# Altium project MU_MP_39_V1.PrjPcb (part 2 of 5)

## Sheet 05 CPU_PWR.SchDoc
size 420 x 297 mm; Address1: Address1; Address2: Address2; Address3: Address3; Address4: Address4; DocumentNumber: АБВГ.123456.001 Э3; SheetNumber: 5; SheetTotal: 23; Scale: 1:1; DocumentType: Схема электрическая принципиальная; FirstReferrence: АБВГ.123456.001
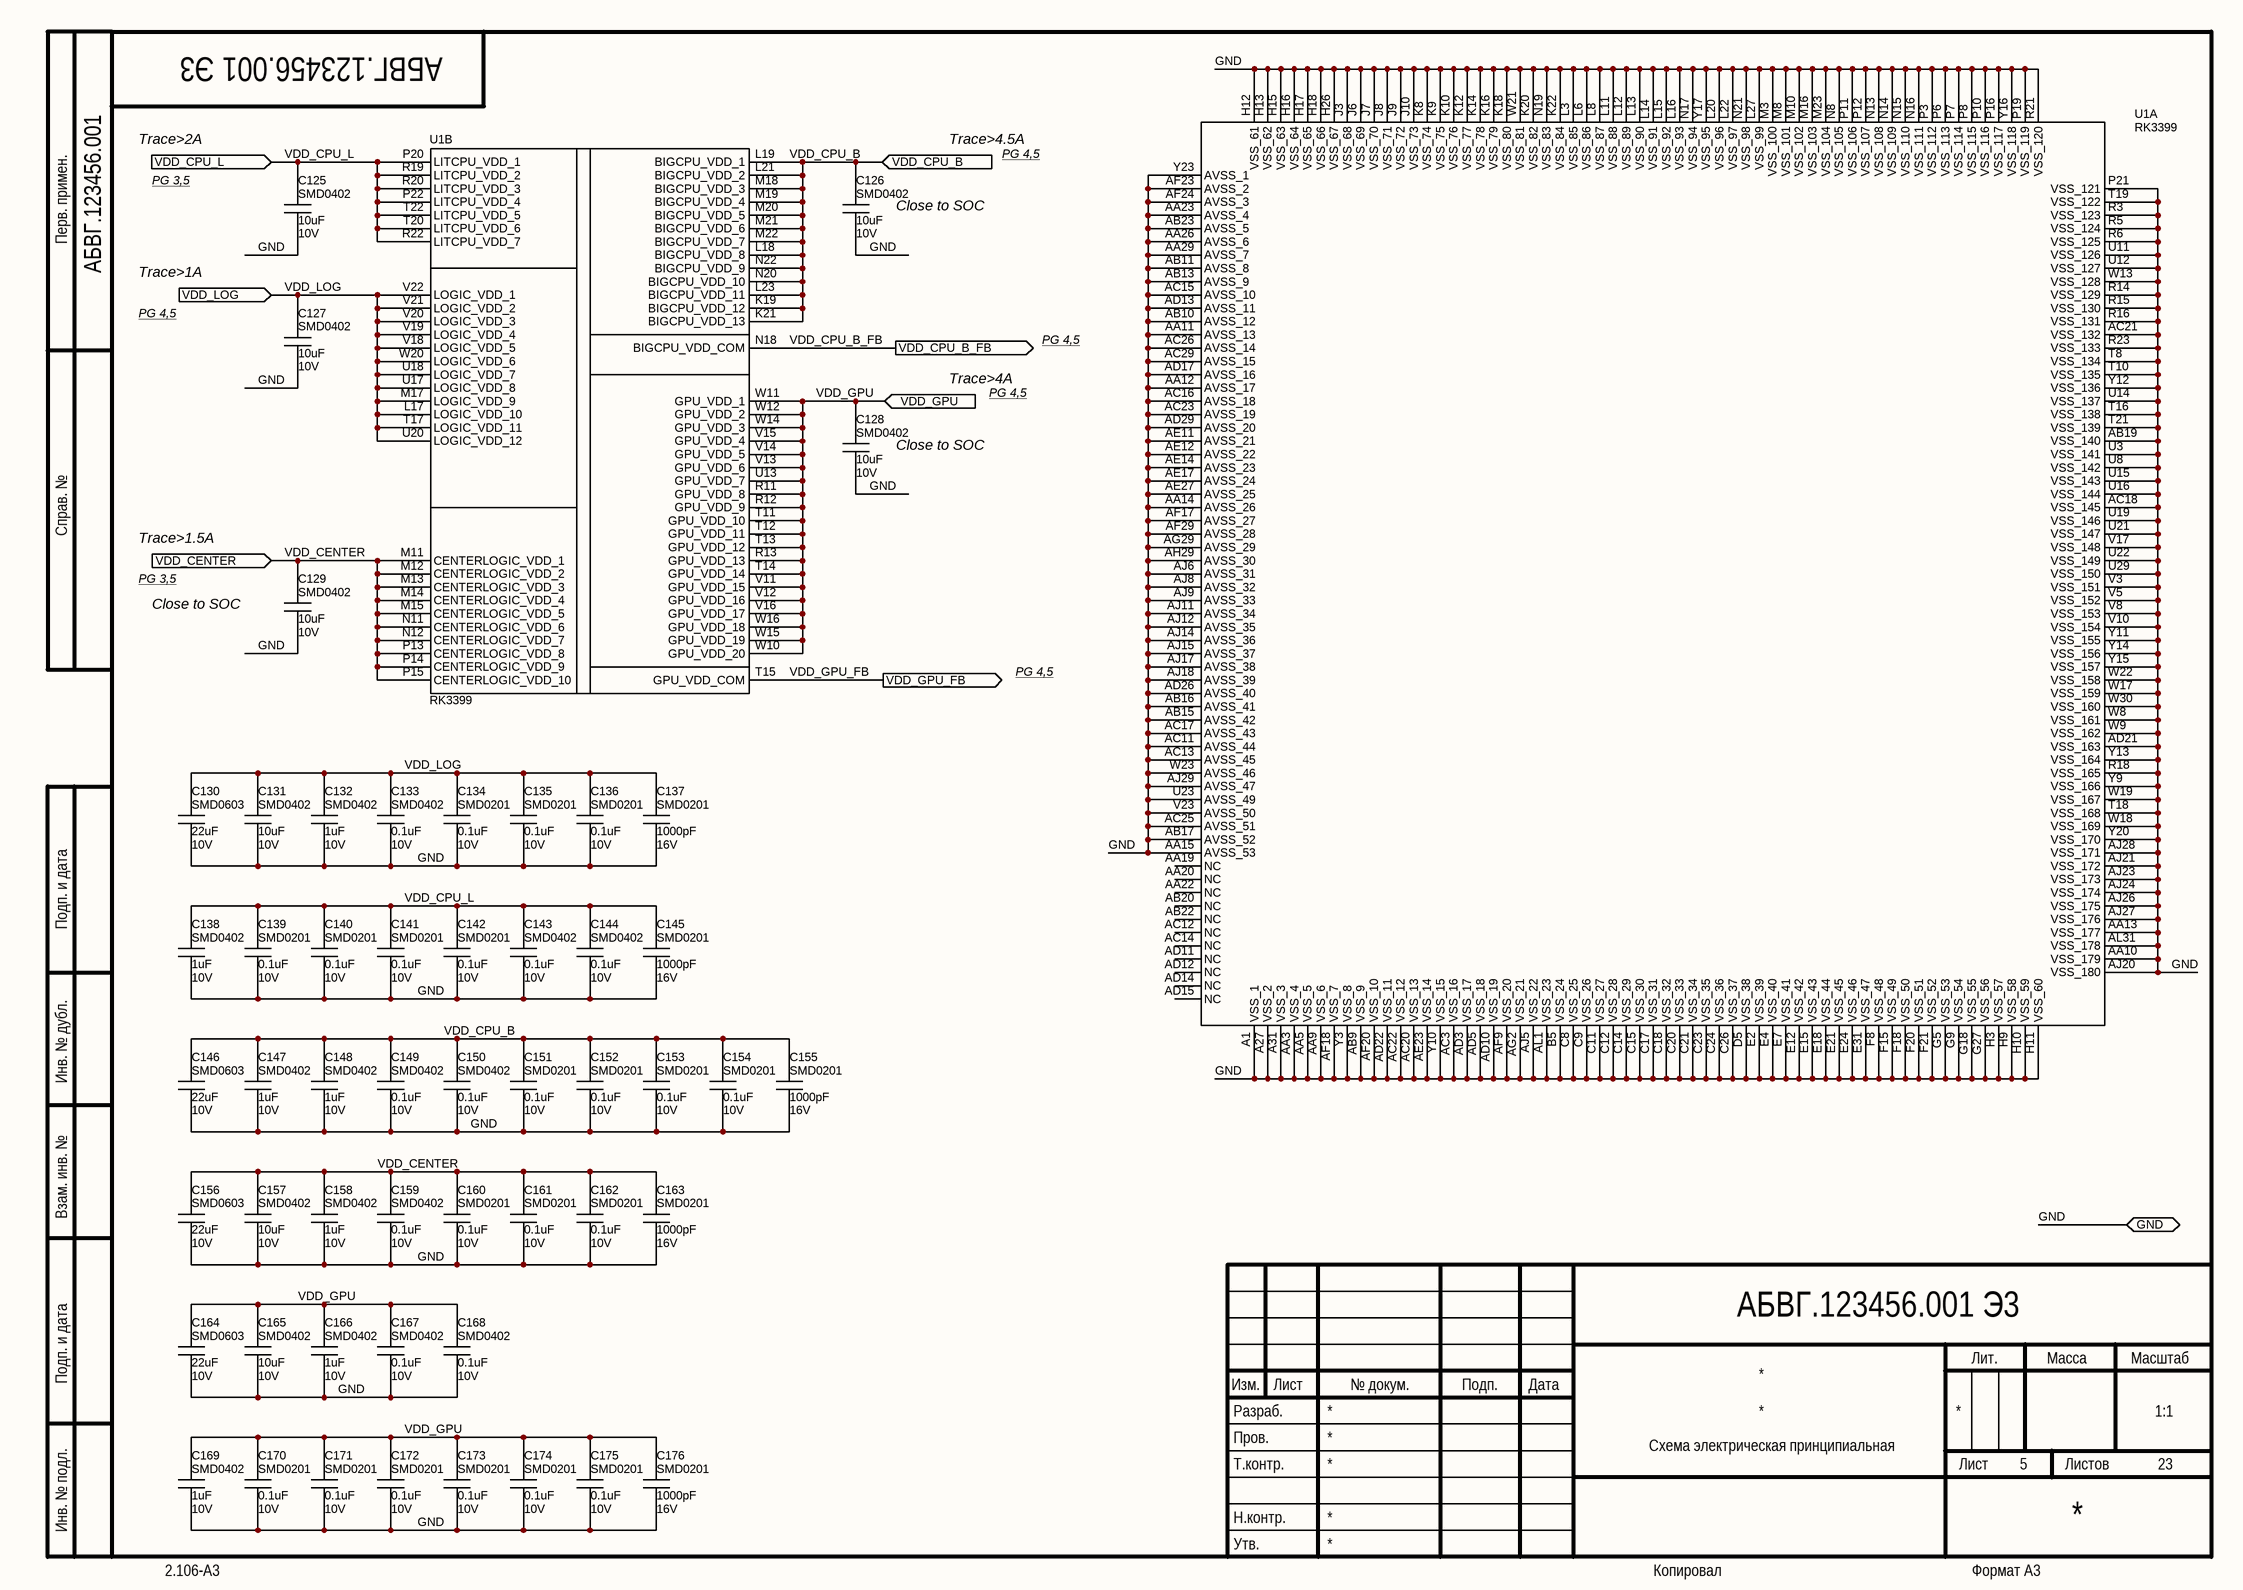
[diagram p4: 05 CPU_PWR.SchDoc]

### Parts
C125  Package: SMD0402  Voltage: 10V  [CAP_SMD_0402_small]  (hidden comment: 10uF)
C126  Package: SMD0402  Voltage: 10V  [CAP_SMD_0402]  (hidden comment: 10uF)
C127  Package: SMD0402  Voltage: 10V  [CAP_SMD_0402_small]  (hidden comment: 10uF)
C128  Package: SMD0402  Voltage: 10V  [CAP_SMD_0402_small]  (hidden comment: 10uF)
C129  Package: SMD0402  Voltage: 10V  [CAP_SMD_0402]  (hidden comment: 10uF)
C130  Package: SMD0603  Voltage: 10V  [CAP_SMD_0603]  (hidden comment: 22uF)
C131  Package: SMD0402  Voltage: 10V  [CAP_SMD_0402_small]  (hidden comment: 10uF)
C132  Package: SMD0402  Voltage: 10V  [CAP_SMD_0402]  (hidden comment: 1uF)
C133  Package: SMD0402  Voltage: 10V  [CAP_SMD_0402]  (hidden comment: 0.1uF)
C134  Package: SMD0201  Voltage: 10V  [CAP_SMD_0201]  (hidden comment: 0.1uF)
C135  Package: SMD0201  Voltage: 10V  [CAP_SMD_0201]  (hidden comment: 0.1uF)
C136  Package: SMD0201  Voltage: 10V  [CAP_SMD_0201]  (hidden comment: 0.1uF)
C137  Package: SMD0201  Voltage: 16V  [CAP_SMD_0201]  (hidden comment: 1000pF)
C138  Package: SMD0402  Voltage: 10V  [CAP_SMD_0402]  (hidden comment: 1uF)
C139  Package: SMD0201  Voltage: 10V  [CAP_SMD_0201]  (hidden comment: 0.1uF)
C140  Package: SMD0201  Voltage: 10V  [CAP_SMD_0201]  (hidden comment: 0.1uF)
C141  Package: SMD0201  Voltage: 10V  [CAP_SMD_0201]  (hidden comment: 0.1uF)
C142  Package: SMD0201  Voltage: 10V  [CAP_SMD_0201]  (hidden comment: 0.1uF)
C143  Package: SMD0402  Voltage: 10V  [CAP_SMD_0402]  (hidden comment: 0.1uF)
C144  Package: SMD0402  Voltage: 10V  [CAP_SMD_0402]  (hidden comment: 0.1uF)
C145  Package: SMD0201  Voltage: 16V  [CAP_SMD_0201]  (hidden comment: 1000pF)
C146  Package: SMD0603  Voltage: 10V  [CAP_SMD_0603]  (hidden comment: 22uF)
C147  Package: SMD0402  Voltage: 10V  [CAP_SMD_0402]  (hidden comment: 1uF)
C148  Package: SMD0402  Voltage: 10V  [CAP_SMD_0402_small]  (hidden comment: 1uF)
C149  Package: SMD0402  Voltage: 10V  [CAP_SMD_0402]  (hidden comment: 0.1uF)
C150  Package: SMD0402  Voltage: 10V  [CAP_SMD_0402]  (hidden comment: 0.1uF)
C151  Package: SMD0201  Voltage: 10V  [CAP_SMD_0201]  (hidden comment: 0.1uF)
C152  Package: SMD0201  Voltage: 10V  [CAP_SMD_0201]  (hidden comment: 0.1uF)
C153  Package: SMD0201  Voltage: 10V  [CAP_SMD_0201]  (hidden comment: 0.1uF)
C154  Package: SMD0201  Voltage: 10V  [CAP_SMD_0201]  (hidden comment: 0.1uF)
C155  Package: SMD0201  Voltage: 16V  [CAP_SMD_0201]  (hidden comment: 1000pF)
C156  Package: SMD0603  Voltage: 10V  [CAP_SMD_0603]  (hidden comment: 22uF)
C157  Package: SMD0402  Voltage: 10V  [CAP_SMD_0402_small]  (hidden comment: 10uF)
C158  Package: SMD0402  Voltage: 10V  [CAP_SMD_0402_small]  (hidden comment: 1uF)
C159  Package: SMD0402  Voltage: 10V  [CAP_SMD_0402]  (hidden comment: 0.1uF)
C160  Package: SMD0201  Voltage: 10V  [CAP_SMD_0201]  (hidden comment: 0.1uF)
C161  Package: SMD0201  Voltage: 10V  [CAP_SMD_0201]  (hidden comment: 0.1uF)
C162  Package: SMD0201  Voltage: 10V  [CAP_SMD_0201]  (hidden comment: 0.1uF)
C163  Package: SMD0201  Voltage: 16V  [CAP_SMD_0201]  (hidden comment: 1000pF)
C164  Package: SMD0603  Voltage: 10V  [CAP_SMD_0603]  (hidden comment: 22uF)
C165  Package: SMD0402  Voltage: 10V  [CAP_SMD_0402]  (hidden comment: 10uF)
C166  Package: SMD0402  Voltage: 10V  [CAP_SMD_0402]  (hidden comment: 1uF)
C167  Package: SMD0402  Voltage: 10V  [CAP_SMD_0402]  (hidden comment: 0.1uF)
C168  Package: SMD0402  Voltage: 10V  [CAP_SMD_0402]  (hidden comment: 0.1uF)
C169  Package: SMD0402  Voltage: 10V  [CAP_SMD_0402_small]  (hidden comment: 1uF)
C170  Package: SMD0201  Voltage: 10V  [CAP_SMD_0201]  (hidden comment: 0.1uF)
C171  Package: SMD0201  Voltage: 10V  [CAP_SMD_0201]  (hidden comment: 0.1uF)
C172  Package: SMD0201  Voltage: 10V  [CAP_SMD_0201]  (hidden comment: 0.1uF)
C173  Package: SMD0201  Voltage: 10V  [CAP_SMD_0201]  (hidden comment: 0.1uF)
C174  Package: SMD0201  Voltage: 10V  [CAP_SMD_0201]  (hidden comment: 0.1uF)
C175  Package: SMD0201  Voltage: 10V  [CAP_SMD_0201]  (hidden comment: 0.1uF)
C176  Package: SMD0201  Voltage: 16V  [CAP_SMD_0201]  (hidden comment: 1000pF)
U1  value RK3399  [BGA828C65P31X31_2100X2100X161N]  (hidden comment: RK3399_FF)  (parts A,B of 23)

### Ports
GND (bidir), VDD_CENTER (in), VDD_CPU_B (in), VDD_CPU_B_FB (out), VDD_CPU_L (in), VDD_GPU (in), VDD_GPU_FB (out), VDD_LOG (in)

### Nets
GND: C125.2 C126.2 C127.2 C128.2 C129.2 C130.1 C131.2 C132.2 C133.2 C134.2 C135.2 C136.2 C137.2 C138.2 C139.2 C140.2 C141.2 C142.2 C143.2 C144.2 C145.2 C146.1 C147.2 C148.2 C149.2 C150.2 C151.2 C152.2 C153.2 C154.2 C155.2 C156.1 C157.2 C158.2 C159.2 C160.2 C161.2 C162.2 C163.2 C164.1 C165.2 C166.2 C167.2 C168.2 C169.2 C170.2 C171.2 C172.2 C173.2 C174.2 C175.2 C176.2 U1.A1(VSS_1) U1.A27(VSS_2) U1.A31(VSS_3) U1.AA3(VSS_4) U1.AA5(VSS_5) U1.AA9(VSS_6) U1.AA10(VSS_179) U1.AA11(AVSS_13) U1.AA12(AVSS_17) U1.AA13(VSS_177) U1.AA14(AVSS_26) U1.AA15(AVSS_53) U1.AA23(AVSS_4) U1.AA26(AVSS_6) U1.AA29(AVSS_7) U1.AB9(VSS_9) U1.AB10(AVSS_12) U1.AB11(AVSS_8) U1.AB13(AVSS_9) U1.AB15(AVSS_42) U1.AB16(AVSS_41) U1.AB17(AVSS_52) U1.AB19(VSS_140) U1.AB23(AVSS_5) U1.AC3(VSS_16) U1.AC11(AVSS_44) U1.AC13(AVSS_45) U1.AC15(AVSS_10) U1.AC16(AVSS_18) U1.AC17(AVSS_43) U1.AC18(VSS_145) U1.AC20(VSS_13) U1.AC21(VSS_132) U1.AC22(VSS_12) U1.AC23(AVSS_19) U1.AC25(AVSS_51) U1.AC26(AVSS_14) U1.AC29(AVSS_15) U1.AD3(VSS_17) U1.AD5(VSS_18) U1.AD10(VSS_19) U1.AD13(AVSS_11) U1.AD17(AVSS_16) U1.AD21(VSS_163) U1.AD22(VSS_11) U1.AD26(AVSS_40) U1.AD29(AVSS_20) U1.AE11(AVSS_21) U1.AE12(AVSS_22) U1.AE14(AVSS_23) U1.AE17(AVSS_24) U1.AE23(VSS_14) U1.AE27(AVSS_25) U1.AF9(VSS_20) U1.AF17(AVSS_27) U1.AF18(VSS_7) U1.AF20(VSS_10) U1.AF23(AVSS_2) U1.AF24(AVSS_3) U1.AF29(AVSS_28) U1.AG2(VSS_21) U1.AG29(AVSS_29) U1.AH29(AVSS_30) U1.AJ5(VSS_22) U1.AJ6(AVSS_31) U1.AJ8(AVSS_32) U1.AJ9(AVSS_33) U1.AJ11(AVSS_34) U1.AJ12(AVSS_35) U1.AJ14(AVSS_36) U1.AJ15(AVSS_37) U1.AJ17(AVSS_38) U1.AJ18(AVSS_39) U1.AJ20(VSS_180) U1.AJ21(VSS_172) U1.AJ23(VSS_173) U1.AJ24(VSS_174) U1.AJ26(VSS_175) U1.AJ27(VSS_176) U1.AJ28(VSS_171) U1.AJ29(AVSS_47) U1.AL1(VSS_23) U1.AL31(VSS_178) U1.B5(VSS_24) U1.C8(VSS_25) U1.C9(VSS_26) U1.C11(VSS_27) U1.C12(VSS_28) U1.C14(VSS_29) U1.C15(VSS_30) U1.C17(VSS_31) U1.C18(VSS_32) U1.C20(VSS_33) U1.C21(VSS_34) U1.C23(VSS_35) U1.C24(VSS_36) U1.C26(VSS_37) U1.D5(VSS_38) U1.E2(VSS_39) U1.E4(VSS_40) U1.E7(VSS_41) U1.E12(VSS_42) U1.E15(VSS_43) U1.E18(VSS_44) U1.E21(VSS_45) U1.E24(VSS_46) U1.E31(VSS_47) U1.F8(VSS_48) U1.F15(VSS_49) U1.F18(VSS_50) U1.F20(VSS_51) U1.F21(VSS_52) U1.G5(VSS_53) U1.G9(VSS_54) U1.G18(VSS_55) U1.G27(VSS_56) U1.H3(VSS_57) U1.H9(VSS_58) U1.H10(VSS_59) U1.H11(VSS_60) U1.H12(VSS_61) U1.H13(VSS_62) U1.H15(VSS_63) U1.H16(VSS_64) U1.H17(VSS_65) U1.H18(VSS_66) U1.H26(VSS_67) U1.J3(VSS_68) U1.J6(VSS_69) U1.J7(VSS_70) U1.J8(VSS_71) U1.J9(VSS_72) U1.J10(VSS_73) U1.K8(VSS_74) U1.K9(VSS_75) U1.K10(VSS_76) U1.K12(VSS_77) U1.K14(VSS_78) U1.K16(VSS_79) U1.K18(VSS_80) U1.K20(VSS_82) U1.K22(VSS_84) U1.L3(VSS_85) U1.L6(VSS_86) U1.L8(VSS_87) U1.L11(VSS_88) U1.L12(VSS_89) U1.L13(VSS_90) U1.L14(VSS_91) U1.L15(VSS_92) U1.L16(VSS_93) U1.L20(VSS_96) U1.L22(VSS_97) U1.L27(VSS_99) U1.M3(VSS_100) U1.M8(VSS_101) U1.M10(VSS_102) U1.M16(VSS_103) U1.M23(VSS_104) U1.N8(VSS_105) U1.N13(VSS_108) U1.N14(VSS_109) U1.N15(VSS_110) U1.N16(VSS_111) U1.N17(VSS_94) U1.N19(VSS_83) U1.N21(VSS_98) U1.P3(VSS_112) U1.P6(VSS_113) U1.P7(VSS_114) U1.P8(VSS_115) U1.P10(VSS_116) U1.P11(VSS_106) U1.P12(VSS_107) U1.P16(VSS_117) U1.P19(VSS_119) U1.P21(VSS_121) U1.R3(VSS_123) U1.R5(VSS_124) U1.R6(VSS_125) U1.R14(VSS_129) U1.R15(VSS_130) U1.R16(VSS_131) U1.R18(VSS_165) U1.R21(VSS_120) U1.R23(VSS_133) U1.T8(VSS_134) U1.T10(VSS_135) U1.T16(VSS_138) U1.T18(VSS_168) U1.T19(VSS_122) U1.T21(VSS_139) U1.U3(VSS_141) U1.U8(VSS_142) U1.U11(VSS_126) U1.U12(VSS_127) U1.U14(VSS_137) U1.U15(VSS_143) U1.U16(VSS_144) U1.U19(VSS_146) U1.U21(VSS_147) U1.U22(VSS_149) U1.U23(AVSS_49) U1.U29(VSS_150) U1.V3(VSS_151) U1.V5(VSS_152) U1.V8(VSS_153) U1.V10(VSS_154) U1.V17(VSS_148) U1.V23(AVSS_50) U1.W8(VSS_161) U1.W9(VSS_162) U1.W13(VSS_128) U1.W17(VSS_159) U1.W18(VSS_169) U1.W19(VSS_167) U1.W21(VSS_81) U1.W22(VSS_158) U1.W23(AVSS_46) U1.W30(VSS_160) U1.Y3(VSS_8) U1.Y9(VSS_166) U1.Y10(VSS_15) U1.Y11(VSS_155) U1.Y12(VSS_136) U1.Y13(VSS_164) U1.Y14(VSS_156) U1.Y15(VSS_157) U1.Y16(VSS_118) U1.Y17(VSS_95) U1.Y20(VSS_170) U1.Y23(AVSS_1) ; port GND
VDD_CENTER: C129.1 C156.2 C157.1 C158.1 C159.1 C160.1 C161.1 C162.1 C163.1 U1.M11(CENTERLOGIC_VDD_1) U1.M12(CENTERLOGIC_VDD_2) U1.M13(CENTERLOGIC_VDD_3) U1.M14(CENTERLOGIC_VDD_4) U1.M15(CENTERLOGIC_VDD_5) U1.N11(CENTERLOGIC_VDD_6) U1.N12(CENTERLOGIC_VDD_7) U1.P13(CENTERLOGIC_VDD_8) U1.P14(CENTERLOGIC_VDD_9) U1.P15(CENTERLOGIC_VDD_10) ; port VDD_CENTER
VDD_CPU_B: C126.1 C146.2 C147.1 C148.1 C149.1 C150.1 C151.1 C152.1 C153.1 C154.1 C155.1 U1.K19(BIGCPU_VDD_12) U1.K21(BIGCPU_VDD_13) U1.L18(BIGCPU_VDD_8) U1.L19(BIGCPU_VDD_1) U1.L21(BIGCPU_VDD_2) U1.L23(BIGCPU_VDD_11) U1.M18(BIGCPU_VDD_3) U1.M19(BIGCPU_VDD_4) U1.M20(BIGCPU_VDD_5) U1.M21(BIGCPU_VDD_6) U1.M22(BIGCPU_VDD_7) U1.N20(BIGCPU_VDD_10) U1.N22(BIGCPU_VDD_9) ; port VDD_CPU_B
VDD_CPU_B_FB: U1.N18(BIGCPU_VDD_COM) ; port VDD_CPU_B_FB
VDD_CPU_L: C125.1 C138.1 C139.1 C140.1 C141.1 C142.1 C143.1 C144.1 C145.1 U1.P20(LITCPU_VDD_1) U1.P22(LITCPU_VDD_4) U1.R19(LITCPU_VDD_2) U1.R20(LITCPU_VDD_3) U1.R22(LITCPU_VDD_7) U1.T20(LITCPU_VDD_6) U1.T22(LITCPU_VDD_5) ; port VDD_CPU_L
VDD_GPU: C128.1 C164.2 C165.1 C166.1 C167.1 C168.1 C169.1 C170.1 C171.1 C172.1 C173.1 C174.1 C175.1 C176.1 U1.R11(GPU_VDD_8) U1.R12(GPU_VDD_9) U1.R13(GPU_VDD_13) U1.T11(GPU_VDD_10) U1.T12(GPU_VDD_11) U1.T13(GPU_VDD_12) U1.T14(GPU_VDD_14) U1.U13(GPU_VDD_7) U1.V11(GPU_VDD_15) U1.V12(GPU_VDD_16) U1.V13(GPU_VDD_6) U1.V14(GPU_VDD_5) U1.V15(GPU_VDD_4) U1.V16(GPU_VDD_17) U1.W10(GPU_VDD_20) U1.W11(GPU_VDD_1) U1.W12(GPU_VDD_2) U1.W14(GPU_VDD_3) U1.W15(GPU_VDD_19) U1.W16(GPU_VDD_18) ; port VDD_GPU
VDD_GPU_FB: U1.T15(GPU_VDD_COM) ; port VDD_GPU_FB
VDD_LOG: C127.1 C130.2 C131.1 C132.1 C133.1 C134.1 C135.1 C136.1 C137.1 U1.L17(LOGIC_VDD_10) U1.M17(LOGIC_VDD_9) U1.T17(LOGIC_VDD_11) U1.U17(LOGIC_VDD_8) U1.U18(LOGIC_VDD_7) U1.U20(LOGIC_VDD_12) U1.V18(LOGIC_VDD_5) U1.V19(LOGIC_VDD_4) U1.V20(LOGIC_VDD_3) U1.V21(LOGIC_VDD_2) U1.V22(LOGIC_VDD_1) U1.W20(LOGIC_VDD_6) ; port VDD_LOG

Not connected (* = marked no-connect by the designer): U1 AA19(NC) AA20(NC) AA22(NC) AB20(NC) AB22(NC) AC12(NC) AC14(NC) AD11(NC) AD12(NC) AD14(NC) AD15(NC)

### Notes on the sheet
- Trace>2A
- PG 3,5
- Trace>4.5A
- PG 4,5
- Перв. примен.
- (near C126) Close to SOC
- Trace>1A
- Trace>4A
- (near C128) Close to SOC
- Справ. №
- Trace>1.5A
- Close to SOC
- Подп. и дата
- Инв. № дубл.
- Взам. инв. №
- Разраб.
- Изм.
- Лист
- № докум.
- Подп.
- Дата
- Лит.
- Масса
- Масштаб
- Пров.
- Т.контр.
- Листов
- Инв. № подл.
- Утв.
- Н.контр.
- 2.106-A3
- Копировал
- Формат А3

### Library data of the parts
C125-C129 C131 C157 C165 = Ceramic_Cap: PartNumber: CC0402MRX5R6BB106; ComponentType: SMD Ceramic Chip Capacitor; Manufacter: *; Tolerance: *; Value: 10uF
  C125 C127 C128 C131 C157: ClassName: Solder_Clearence
  C126 C129 C165: ClassName: *
C130 C146 C156 C164 = Ceramic_Cap: PartNumber: CL10A226MP8NUNE; ComponentType: SMD Ceramic Chip Capacitor; Manufacter: *; Tolerance: *; ClassName: *; Value: 22uF
C132 C138 C147 C148 C158 C166 C169 = Ceramic_Cap: PartNumber: CC0402KRX5R6BB105; ComponentType: SMD Ceramic Chip Capacitor; Manufacter: *; Tolerance: *; Value: 1uF
  C132 C138 C147 C166: ClassName: *
  C148 C158 C169: ClassName: Solder_Clearence
C133 C143 C144 C149 C150 C159 C167 C168 = Ceramic_Cap: PartNumber: CC0402KRX5R6BB104; ComponentType: SMD Ceramic Chip Capacitor; Manufacter: *; Tolerance: *; ClassName: *; Value: 0.1uF
C134-C136 C139-C142 C151-C154 C160-C162 C170-C175 = Ceramic_Cap: PartNumber: CC0201KRX5R6BB104; ComponentType: SMD Ceramic Chip Capacitor; Manufacter: *; Tolerance: *; ClassName: *; Value: 0.1uF
C137 C145 C155 C163 C176 = Ceramic_Cap: PartNumber: CC0201KRX7R7BB102; ComponentType: SMD Ceramic Chip Capacitor; Manufacter: *; Tolerance: *; ClassName: *; Value: 1000pF
U1 = RK3399_FF: Package: BGA828; ComponentType: *; Manufacter: *; PartNumber: RK3399; ClassName: *

## Sheet 06 CPU_RAM.SchDoc
size 420 x 297 mm; Address1: Address1; Address2: Address2; Address3: Address3; Address4: Address4; DocumentNumber: АБВГ.123456.001 Э3; SheetNumber: 6; SheetTotal: 23; Scale: 1:1; DocumentType: Схема электрическая принципиальная; FirstReferrence: АБВГ.123456.001
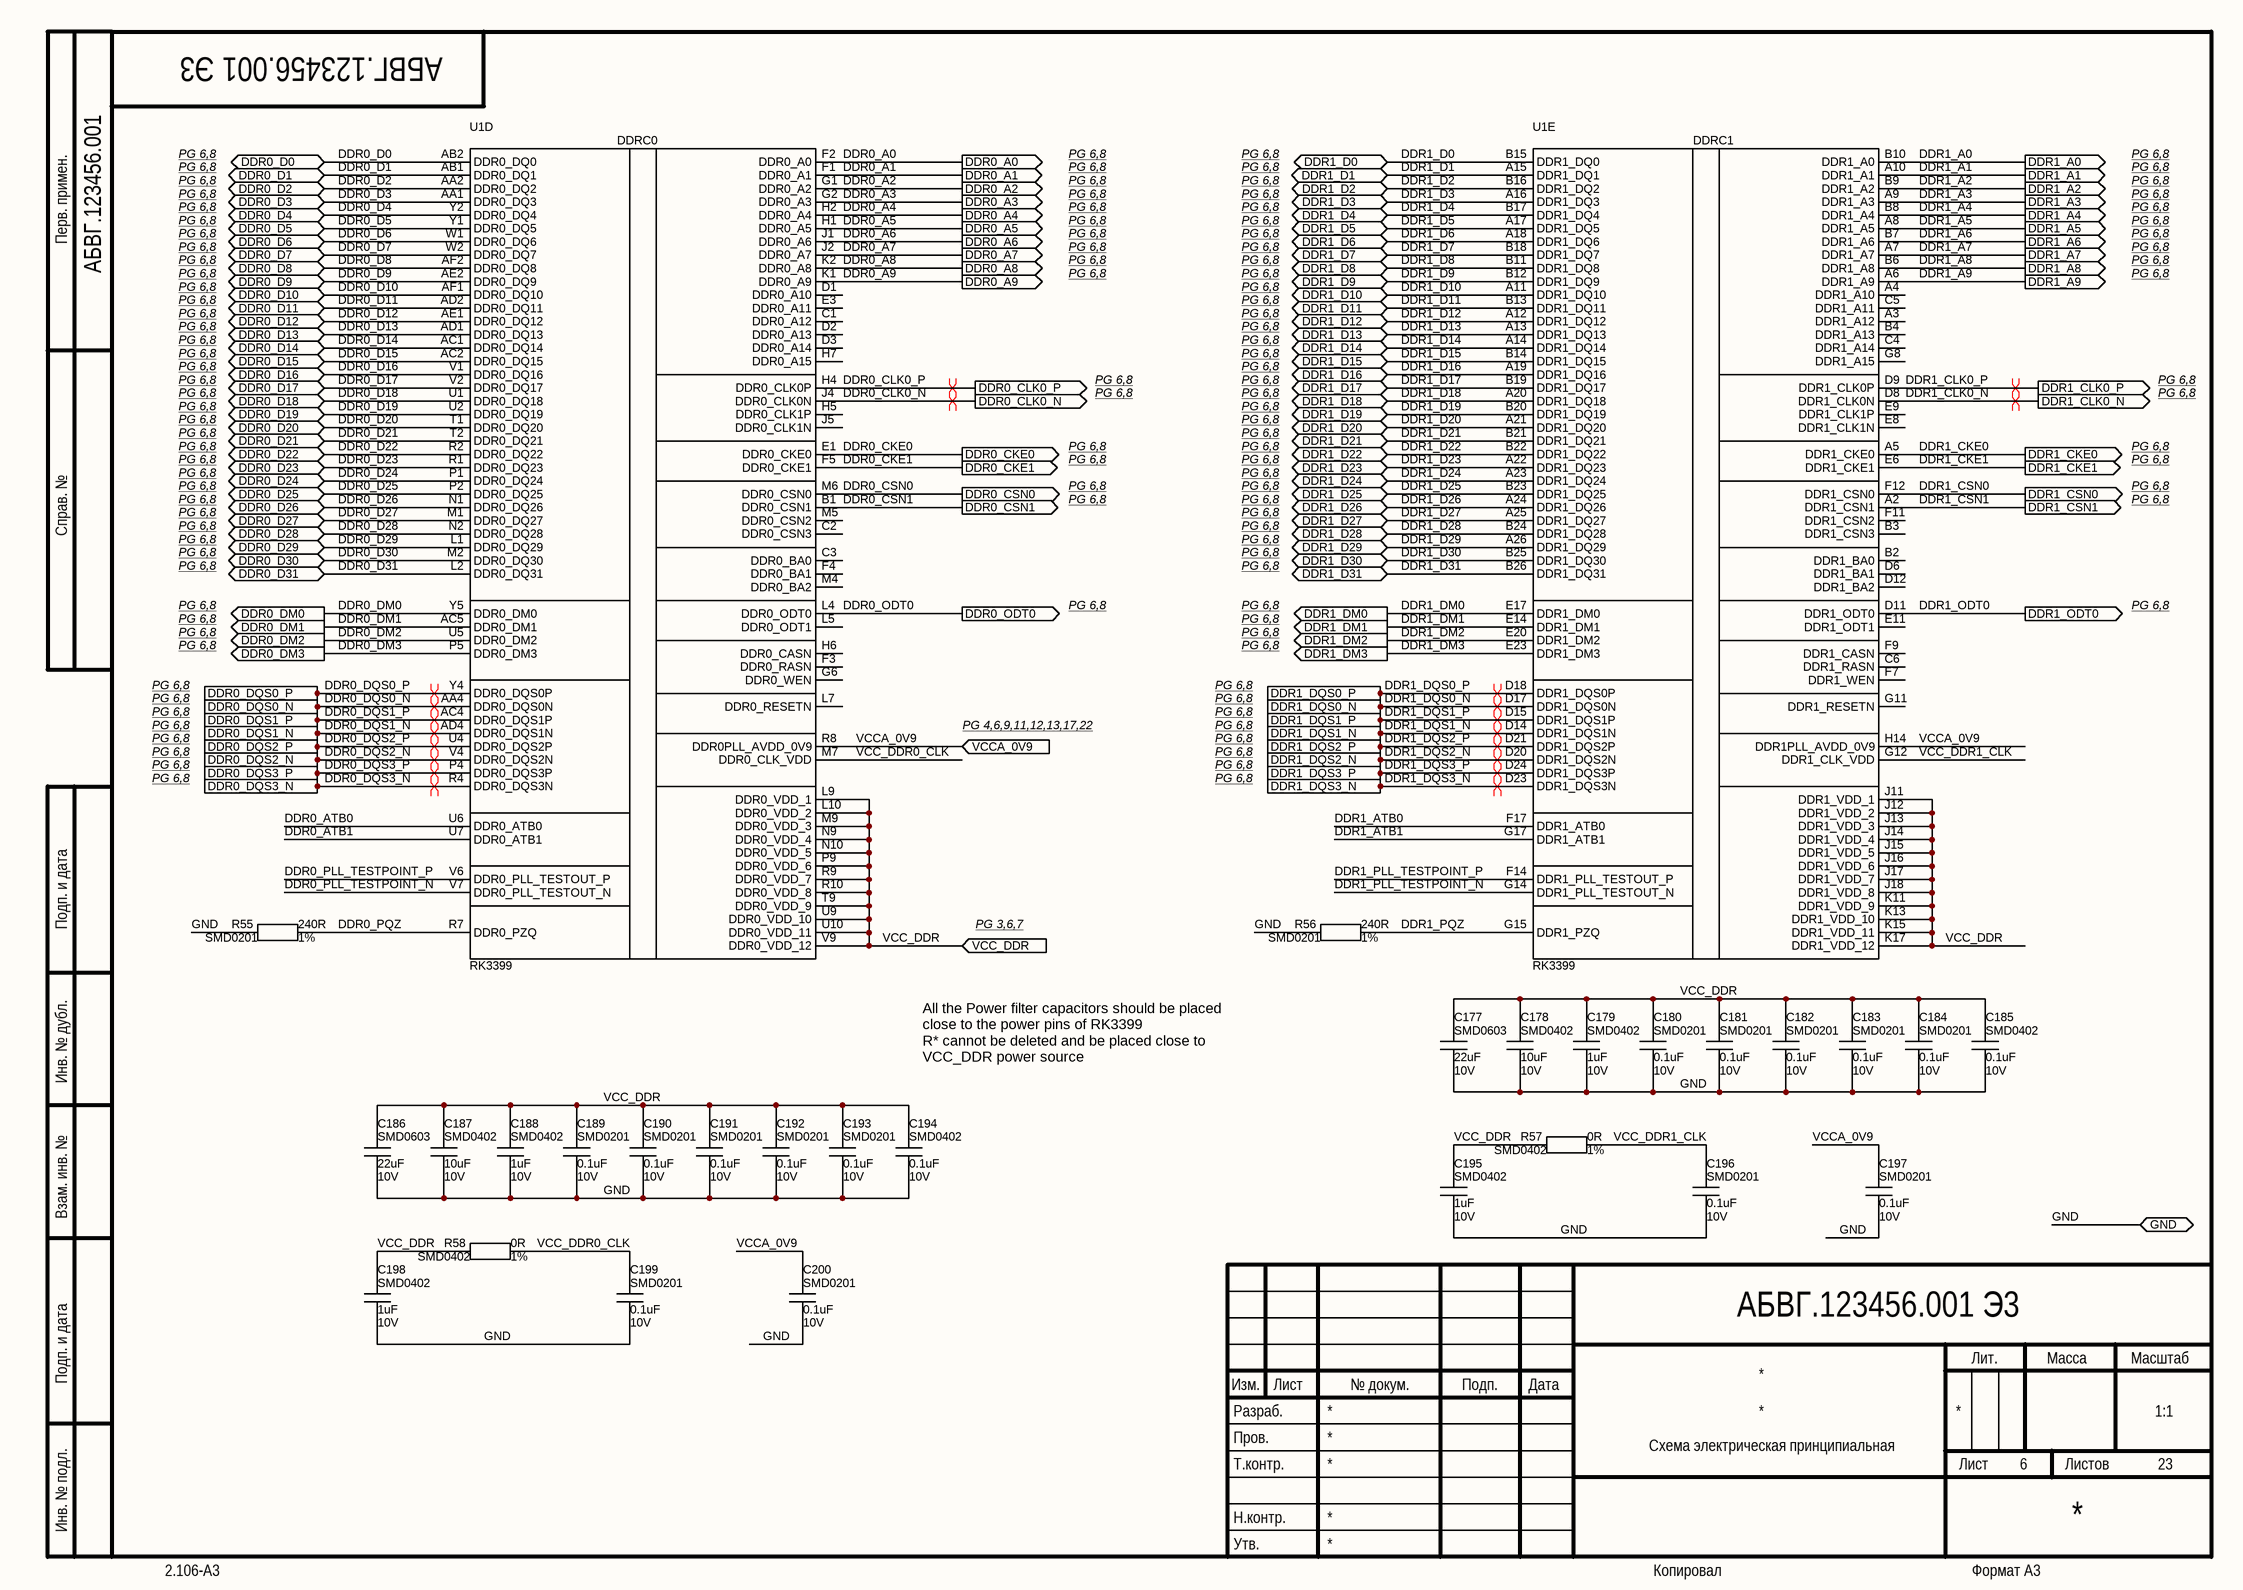
[diagram p5: 06 CPU_RAM.SchDoc]

### Parts
C177  Package: SMD0603  Voltage: 10V  [CAP_SMD_0603]  (hidden comment: 22uF)
C178  Package: SMD0402  Voltage: 10V  [CAP_SMD_0402_small]  (hidden comment: 10uF)
C179  Package: SMD0402  Voltage: 10V  [CAP_SMD_0402_small]  (hidden comment: 1uF)
C180  Package: SMD0201  Voltage: 10V  [CAP_SMD_0201]  (hidden comment: 0.1uF)
C181  Package: SMD0201  Voltage: 10V  [CAP_SMD_0201]  (hidden comment: 0.1uF)
C182  Package: SMD0201  Voltage: 10V  [CAP_SMD_0201]  (hidden comment: 0.1uF)
C183  Package: SMD0201  Voltage: 10V  [CAP_SMD_0201]  (hidden comment: 0.1uF)
C184  Package: SMD0201  Voltage: 10V  [CAP_SMD_0201]  (hidden comment: 0.1uF)
C185  Package: SMD0402  Voltage: 10V  [CAP_SMD_0402]  (hidden comment: 0.1uF)
C186  Package: SMD0603  Voltage: 10V  [CAP_SMD_0603]  (hidden comment: 22uF)
C187  Package: SMD0402  Voltage: 10V  [CAP_SMD_0402_small]  (hidden comment: 10uF)
C188  Package: SMD0402  Voltage: 10V  [CAP_SMD_0402_small]  (hidden comment: 1uF)
C189  Package: SMD0201  Voltage: 10V  [CAP_SMD_0201]  (hidden comment: 0.1uF)
C190  Package: SMD0201  Voltage: 10V  [CAP_SMD_0201]  (hidden comment: 0.1uF)
C191  Package: SMD0201  Voltage: 10V  [CAP_SMD_0201]  (hidden comment: 0.1uF)
C192  Package: SMD0201  Voltage: 10V  [CAP_SMD_0201]  (hidden comment: 0.1uF)
C193  Package: SMD0201  Voltage: 10V  [CAP_SMD_0201]  (hidden comment: 0.1uF)
C194  Package: SMD0402  Voltage: 10V  [CAP_SMD_0402]  (hidden comment: 0.1uF)
C195  Package: SMD0402  Voltage: 10V  [CAP_SMD_0402_small]  (hidden comment: 1uF)
C196  Package: SMD0201  Voltage: 10V  [CAP_SMD_0201]  (hidden comment: 0.1uF)
C197  Package: SMD0201  Voltage: 10V  [CAP_SMD_0201]  (hidden comment: 0.1uF)
C198  Package: SMD0402  Voltage: 10V  [CAP_SMD_0402_small]  (hidden comment: 1uF)
C199  Package: SMD0201  Voltage: 10V  [CAP_SMD_0201]  (hidden comment: 0.1uF)
C200  Package: SMD0201  Voltage: 10V  [CAP_SMD_0201]  (hidden comment: 0.1uF)
R55  Package: SMD0201  Tolerance: 1%  [RES_SMD_0201]  (hidden comment: 240R)
R56  Package: SMD0201  Tolerance: 1%  [RES_SMD_0201]  (hidden comment: 240R)
R57  Package: SMD0402  Tolerance: 1%  [RES_SMD_0402_SMALL]  (hidden comment: 0R)
R58  Package: SMD0402  Tolerance: 1%  [RES_SMD_0402_SMALL]  (hidden comment: 0R)
U1  value RK3399  [BGA828C65P31X31_2100X2100X161N]  (hidden comment: RK3399_FF)  (parts D,E of 23)

### Ports
DDR0_A0 (out), DDR0_A1 (out), DDR0_A2 (out), DDR0_A3 (out), DDR0_A4 (out), DDR0_A5 (out), DDR0_A6 (out), DDR0_A7 (out), DDR0_A8 (out), DDR0_A9 (out), DDR0_CKE0 (out), DDR0_CKE1 (out), DDR0_CLK0_N (out), DDR0_CLK0_P (out), DDR0_CSN0 (out), DDR0_CSN1 (out), DDR0_D0 (bidir), DDR0_D1 (bidir), DDR0_D2 (bidir), DDR0_D3 (bidir), DDR0_D4 (bidir), DDR0_D5 (bidir), DDR0_D6 (bidir), DDR0_D7 (bidir), DDR0_D8 (bidir), DDR0_D9 (bidir), DDR0_D10 (bidir), DDR0_D11 (bidir), DDR0_D12 (bidir), DDR0_D13 (bidir), DDR0_D14 (bidir), DDR0_D15 (bidir), DDR0_D16 (bidir), DDR0_D17 (bidir), DDR0_D18 (bidir), DDR0_D19 (bidir), DDR0_D20 (bidir), DDR0_D21 (bidir), DDR0_D22 (bidir), DDR0_D23 (bidir), DDR0_D24 (bidir), DDR0_D25 (bidir), DDR0_D26 (bidir), DDR0_D27 (bidir), DDR0_D28 (bidir), DDR0_D29 (bidir), DDR0_D30 (bidir), DDR0_D31 (bidir), DDR0_DM0 (out), DDR0_DM1 (out), DDR0_DM2 (out), DDR0_DM3 (out), DDR0_DQS0_N (out), DDR0_DQS0_P (out), DDR0_DQS1_N (out), DDR0_DQS1_P (out), DDR0_DQS2_N (out), DDR0_DQS2_P (out), DDR0_DQS3_N (out), DDR0_DQS3_P (out), DDR0_ODT0 (out), DDR1_A0 (out), DDR1_A1 (out), DDR1_A2 (out), DDR1_A3 (out), DDR1_A4 (out), DDR1_A5 (out), DDR1_A6 (out), DDR1_A7 (out), DDR1_A8 (out), DDR1_A9 (out), DDR1_CKE0 (out), DDR1_CKE1 (out), DDR1_CLK0_N (out), DDR1_CLK0_P (out), DDR1_CSN0 (out), DDR1_CSN1 (out), DDR1_D0 (bidir), DDR1_D1 (bidir), DDR1_D2 (bidir), DDR1_D3 (bidir), DDR1_D4 (bidir), DDR1_D5 (bidir), DDR1_D6 (bidir), DDR1_D7 (bidir), DDR1_D8 (bidir), DDR1_D9 (bidir), DDR1_D10 (bidir), DDR1_D11 (bidir), DDR1_D12 (bidir), DDR1_D13 (bidir), DDR1_D14 (bidir), DDR1_D15 (bidir), DDR1_D16 (bidir), DDR1_D17 (bidir), DDR1_D18 (bidir), DDR1_D19 (bidir), DDR1_D20 (bidir), DDR1_D21 (bidir), DDR1_D22 (bidir), DDR1_D23 (bidir), DDR1_D24 (bidir), DDR1_D25 (bidir), DDR1_D26 (bidir), DDR1_D27 (bidir), DDR1_D28 (bidir), DDR1_D29 (bidir), DDR1_D30 (bidir), DDR1_D31 (bidir), DDR1_DM0 (out), DDR1_DM1 (out), DDR1_DM2 (out), DDR1_DM3 (out), DDR1_DQS0_N (out), DDR1_DQS0_P (out), DDR1_DQS1_N (out), DDR1_DQS1_P (out), DDR1_DQS2_N (out), DDR1_DQS2_P (out), DDR1_DQS3_N (out), DDR1_DQS3_P (out), DDR1_ODT0 (out), GND (bidir), VCC_DDR (in), VCCA_0V9 (in)

### Nets
DDR0_A0: U1.F2(DDR0_A0) ; port DDR0_A0
DDR0_A1: U1.F1(DDR0_A1) ; port DDR0_A1
DDR0_A2: U1.G1(DDR0_A2) ; port DDR0_A2
DDR0_A3: U1.G2(DDR0_A3) ; port DDR0_A3
DDR0_A4: U1.H2(DDR0_A4) ; port DDR0_A4
DDR0_A5: U1.H1(DDR0_A5) ; port DDR0_A5
DDR0_A6: U1.J1(DDR0_A6) ; port DDR0_A6
DDR0_A7: U1.J2(DDR0_A7) ; port DDR0_A7
DDR0_A8: U1.K2(DDR0_A8) ; port DDR0_A8
DDR0_A9: U1.K1(DDR0_A9) ; port DDR0_A9
DDR0_ATB0: U1.U6(DDR0_ATB0)
DDR0_ATB1: U1.U7(DDR0_ATB1)
DDR0_CKE0: U1.E1(DDR0_CKE0) ; port DDR0_CKE0
DDR0_CKE1: U1.F5(DDR0_CKE1) ; port DDR0_CKE1
DDR0_CLK0_N: U1.J4(DDR0_CLK0N) ; port DDR0_CLK0_N
DDR0_CLK0_P: U1.H4(DDR0_CLK0P) ; port DDR0_CLK0_P
DDR0_CSN0: U1.M6(DDR0_CSN0) ; port DDR0_CSN0
DDR0_CSN1: U1.B1(DDR0_CSN1) ; port DDR0_CSN1
DDR0_D0: U1.AB2(DDR0_DQ0) ; port DDR0_D0
DDR0_D1: U1.AB1(DDR0_DQ1) ; port DDR0_D1
DDR0_D2: U1.AA2(DDR0_DQ2) ; port DDR0_D2
DDR0_D3: U1.AA1(DDR0_DQ3) ; port DDR0_D3
DDR0_D4: U1.Y2(DDR0_DQ4) ; port DDR0_D4
DDR0_D5: U1.Y1(DDR0_DQ5) ; port DDR0_D5
DDR0_D6: U1.W1(DDR0_DQ6) ; port DDR0_D6
DDR0_D7: U1.W2(DDR0_DQ7) ; port DDR0_D7
DDR0_D8: U1.AF2(DDR0_DQ8) ; port DDR0_D8
DDR0_D9: U1.AE2(DDR0_DQ9) ; port DDR0_D9
DDR0_D10: U1.AF1(DDR0_DQ10) ; port DDR0_D10
DDR0_D11: U1.AD2(DDR0_DQ11) ; port DDR0_D11
DDR0_D12: U1.AE1(DDR0_DQ12) ; port DDR0_D12
DDR0_D13: U1.AD1(DDR0_DQ13) ; port DDR0_D13
DDR0_D14: U1.AC1(DDR0_DQ14) ; port DDR0_D14
DDR0_D15: U1.AC2(DDR0_DQ15) ; port DDR0_D15
DDR0_D16: U1.V1(DDR0_DQ16) ; port DDR0_D16
DDR0_D17: U1.V2(DDR0_DQ17) ; port DDR0_D17
DDR0_D18: U1.U1(DDR0_DQ18) ; port DDR0_D18
DDR0_D19: U1.U2(DDR0_DQ19) ; port DDR0_D19
DDR0_D20: U1.T1(DDR0_DQ20) ; port DDR0_D20
DDR0_D21: U1.T2(DDR0_DQ21) ; port DDR0_D21
DDR0_D22: U1.R2(DDR0_DQ22) ; port DDR0_D22
DDR0_D23: U1.R1(DDR0_DQ23) ; port DDR0_D23
DDR0_D24: U1.P1(DDR0_DQ24) ; port DDR0_D24
DDR0_D25: U1.P2(DDR0_DQ25) ; port DDR0_D25
DDR0_D26: U1.N1(DDR0_DQ26) ; port DDR0_D26
DDR0_D27: U1.M1(DDR0_DQ27) ; port DDR0_D27
DDR0_D28: U1.N2(DDR0_DQ28) ; port DDR0_D28
DDR0_D29: U1.L1(DDR0_DQ29) ; port DDR0_D29
DDR0_D30: U1.M2(DDR0_DQ30) ; port DDR0_D30
DDR0_D31: U1.L2(DDR0_DQ31) ; port DDR0_D31
DDR0_DM0: U1.Y5(DDR0_DM0) ; port DDR0_DM0
DDR0_DM1: U1.AC5(DDR0_DM1) ; port DDR0_DM1
DDR0_DM2: U1.U5(DDR0_DM2) ; port DDR0_DM2
DDR0_DM3: U1.P5(DDR0_DM3) ; port DDR0_DM3
DDR0_DQS0_N: U1.AA4(DDR0_DQS0N) ; port DDR0_DQS0_N
DDR0_DQS0_P: U1.Y4(DDR0_DQS0P) ; port DDR0_DQS0_P
DDR0_DQS1_N: U1.AD4(DDR0_DQS1N) ; port DDR0_DQS1_N
DDR0_DQS1_P: U1.AC4(DDR0_DQS1P) ; port DDR0_DQS1_P
DDR0_DQS2_N: U1.V4(DDR0_DQS2N) ; port DDR0_DQS2_N
DDR0_DQS2_P: U1.U4(DDR0_DQS2P) ; port DDR0_DQS2_P
DDR0_DQS3_N: U1.R4(DDR0_DQS3N) ; port DDR0_DQS3_N
DDR0_DQS3_P: U1.P4(DDR0_DQS3P) ; port DDR0_DQS3_P
DDR0_ODT0: U1.L4(DDR0_ODT0) ; port DDR0_ODT0
DDR0_PLL_TESTPOINT_N: U1.V7(DDR0_PLL_TESTOUT_N)
DDR0_PLL_TESTPOINT_P: U1.V6(DDR0_PLL_TESTOUT_P)
DDR0_PQZ: R55.1 U1.R7(DDR0_PZQ)
DDR1_A0: U1.B10(DDR1_A0) ; port DDR1_A0
DDR1_A1: U1.A10(DDR1_A1) ; port DDR1_A1
DDR1_A2: U1.B9(DDR1_A2) ; port DDR1_A2
DDR1_A3: U1.A9(DDR1_A3) ; port DDR1_A3
DDR1_A4: U1.B8(DDR1_A4) ; port DDR1_A4
DDR1_A5: U1.A8(DDR1_A5) ; port DDR1_A5
DDR1_A6: U1.B7(DDR1_A6) ; port DDR1_A6
DDR1_A7: U1.A7(DDR1_A7) ; port DDR1_A7
DDR1_A8: U1.B6(DDR1_A8) ; port DDR1_A8
DDR1_A9: U1.A6(DDR1_A9) ; port DDR1_A9
DDR1_ATB0: U1.F17(DDR1_ATB0)
DDR1_ATB1: U1.G17(DDR1_ATB1)
DDR1_CKE0: U1.A5(DDR1_CKE0) ; port DDR1_CKE0
DDR1_CKE1: U1.E6(DDR1_CKE1) ; port DDR1_CKE1
DDR1_CLK0_N: U1.D8(DDR1_CLK0N) ; port DDR1_CLK0_N
DDR1_CLK0_P: U1.D9(DDR1_CLK0P) ; port DDR1_CLK0_P
DDR1_CSN0: U1.F12(DDR1_CSN0) ; port DDR1_CSN0
DDR1_CSN1: U1.A2(DDR1_CSN1) ; port DDR1_CSN1
DDR1_D0: U1.B15(DDR1_DQ0) ; port DDR1_D0
DDR1_D1: U1.A15(DDR1_DQ1) ; port DDR1_D1
DDR1_D2: U1.B16(DDR1_DQ2) ; port DDR1_D2
DDR1_D3: U1.A16(DDR1_DQ3) ; port DDR1_D3
DDR1_D4: U1.B17(DDR1_DQ4) ; port DDR1_D4
DDR1_D5: U1.A17(DDR1_DQ5) ; port DDR1_D5
DDR1_D6: U1.A18(DDR1_DQ6) ; port DDR1_D6
DDR1_D7: U1.B18(DDR1_DQ7) ; port DDR1_D7
DDR1_D8: U1.B11(DDR1_DQ8) ; port DDR1_D8
DDR1_D9: U1.B12(DDR1_DQ9) ; port DDR1_D9
DDR1_D10: U1.A11(DDR1_DQ10) ; port DDR1_D10
DDR1_D11: U1.B13(DDR1_DQ11) ; port DDR1_D11
DDR1_D12: U1.A12(DDR1_DQ12) ; port DDR1_D12
DDR1_D13: U1.A13(DDR1_DQ13) ; port DDR1_D13
DDR1_D14: U1.A14(DDR1_DQ14) ; port DDR1_D14
DDR1_D15: U1.B14(DDR1_DQ15) ; port DDR1_D15
DDR1_D16: U1.A19(DDR1_DQ16) ; port DDR1_D16
DDR1_D17: U1.B19(DDR1_DQ17) ; port DDR1_D17
DDR1_D18: U1.A20(DDR1_DQ18) ; port DDR1_D18
DDR1_D19: U1.B20(DDR1_DQ19) ; port DDR1_D19
DDR1_D20: U1.A21(DDR1_DQ20) ; port DDR1_D20
DDR1_D21: U1.B21(DDR1_DQ21) ; port DDR1_D21
DDR1_D22: U1.B22(DDR1_DQ22) ; port DDR1_D22
DDR1_D23: U1.A22(DDR1_DQ23) ; port DDR1_D23
DDR1_D24: U1.A23(DDR1_DQ24) ; port DDR1_D24
DDR1_D25: U1.B23(DDR1_DQ25) ; port DDR1_D25
DDR1_D26: U1.A24(DDR1_DQ26) ; port DDR1_D26
DDR1_D27: U1.A25(DDR1_DQ27) ; port DDR1_D27
DDR1_D28: U1.B24(DDR1_DQ28) ; port DDR1_D28
DDR1_D29: U1.A26(DDR1_DQ29) ; port DDR1_D29
DDR1_D30: U1.B25(DDR1_DQ30) ; port DDR1_D30
DDR1_D31: U1.B26(DDR1_DQ31) ; port DDR1_D31
DDR1_DM0: U1.E17(DDR1_DM0) ; port DDR1_DM0
DDR1_DM1: U1.E14(DDR1_DM1) ; port DDR1_DM1
DDR1_DM2: U1.E20(DDR1_DM2) ; port DDR1_DM2
DDR1_DM3: U1.E23(DDR1_DM3) ; port DDR1_DM3
DDR1_DQS0_N: U1.D17(DDR1_DQS0N) ; port DDR1_DQS0_N
DDR1_DQS0_P: U1.D18(DDR1_DQS0P) ; port DDR1_DQS0_P
DDR1_DQS1_N: U1.D14(DDR1_DQS1N) ; port DDR1_DQS1_N
DDR1_DQS1_P: U1.D15(DDR1_DQS1P) ; port DDR1_DQS1_P
DDR1_DQS2_N: U1.D20(DDR1_DQS2N) ; port DDR1_DQS2_N
DDR1_DQS2_P: U1.D21(DDR1_DQS2P) ; port DDR1_DQS2_P
DDR1_DQS3_N: U1.D23(DDR1_DQS3N) ; port DDR1_DQS3_N
DDR1_DQS3_P: U1.D24(DDR1_DQS3P) ; port DDR1_DQS3_P
DDR1_ODT0: U1.D11(DDR1_ODT0) ; port DDR1_ODT0
DDR1_PLL_TESTPOINT_N: U1.G14(DDR1_PLL_TESTOUT_N)
DDR1_PLL_TESTPOINT_P: U1.F14(DDR1_PLL_TESTOUT_P)
DDR1_PQZ: R56.1 U1.G15(DDR1_PZQ)
GND: C177.1 C178.2 C179.2 C180.2 C181.2 C182.2 C183.2 C184.2 C185.2 C186.1 C187.2 C188.2 C189.2 C190.2 C191.2 C192.2 C193.2 C194.2 C195.2 C196.2 C197.2 C198.2 C199.2 C200.2 R55.2 R56.2 ; port GND
VCC_DDR: C177.2 C178.1 C179.1 C180.1 C181.1 C182.1 C183.1 C184.1 C185.1 C186.2 C187.1 C188.1 C189.1 C190.1 C191.1 C192.1 C193.1 C194.1 C195.1 C198.1 R57.1 R58.1 U1.J11(DDR1_VDD_1) U1.J12(DDR1_VDD_2) U1.J13(DDR1_VDD_3) U1.J14(DDR1_VDD_4) U1.J15(DDR1_VDD_5) U1.J16(DDR1_VDD_6) U1.J17(DDR1_VDD_7) U1.J18(DDR1_VDD_8) U1.K11(DDR1_VDD_9) U1.K13(DDR1_VDD_10) U1.K15(DDR1_VDD_11) U1.K17(DDR1_VDD_12) U1.L9(DDR0_VDD_1) U1.L10(DDR0_VDD_2) U1.M9(DDR0_VDD_3) U1.N9(DDR0_VDD_4) U1.N10(DDR0_VDD_5) U1.P9(DDR0_VDD_6) U1.R9(DDR0_VDD_7) U1.R10(DDR0_VDD_8) U1.T9(DDR0_VDD_9) U1.U9(DDR0_VDD_10) U1.U10(DDR0_VDD_11) U1.V9(DDR0_VDD_12) ; port VCC_DDR
VCC_DDR0_CLK: C199.1 R58.2 U1.M7(DDR0_CLK_VDD)
VCC_DDR1_CLK: C196.1 R57.2 U1.G12(DDR1_CLK_VDD)
VCCA_0V9: C197.1 C200.1 U1.H14(DDR1PLL_AVDD_0V9) U1.R8(DDR0PLL_AVDD_0V9) ; port VCCA_0V9

Not connected (* = marked no-connect by the designer): U1 A3(DDR1_A12) A4(DDR1_A10) B2(DDR1_BA0) B3(DDR1_CSN3) B4(DDR1_A13) C1(DDR0_A12) C2(DDR0_CSN3) C3(DDR0_BA0) C4(DDR1_A14) C5(DDR1_A11) C6(DDR1_RASN) D1(DDR0_A10) D2(DDR0_A13) D3(DDR0_A14) D6(DDR1_BA1) D12(DDR1_BA2) E3(DDR0_A11) E8(DDR1_CLK1N) E9(DDR1_CLK1P) E11(DDR1_ODT1) F3(DDR0_RASN) F4(DDR0_BA1) F7(DDR1_WEN) F9(DDR1_CASN) F11(DDR1_CSN2) G6(DDR0_WEN) G8(DDR1_A15) G11(DDR1_RESETN) H5(DDR0_CLK1P) H6(DDR0_CASN) H7(DDR0_A15) J5(DDR0_CLK1N) L5(DDR0_ODT1) L7(DDR0_RESETN) M4(DDR0_BA2) M5(DDR0_CSN2)

### Layout directives
differential pair; differential pair class DiffPair_1; net class DiffPair_1: DDR0_CLK0_N, DDR0_CLK0_P, DDR0_DQS0_N, DDR0_DQS0_P, DDR0_DQS1_N, DDR0_DQS1_P, DDR0_DQS2_N, DDR0_DQS2_P, DDR0_DQS3_N, DDR0_DQS3_P
differential pair; net class DiffPair_1; differential pair class DiffPair_1: DDR1_CLK0_N, DDR1_CLK0_P, DDR1_DQS0_N, DDR1_DQS0_P, DDR1_DQS1_N, DDR1_DQS1_P, DDR1_DQS2_N, DDR1_DQS2_P, DDR1_DQS3_N, DDR1_DQS3_P

### Notes on the sheet
- PG 6,8
- Перв. примен.
- Справ. №
- PG 4,6,9,11,12,13,17,22
- Подп. и дата
- PG 3,6,7
- All the Power filter capacitors should be placed
  close to the power pins of RK3399
  R* cannot be deleted and be placed close to
  VCC_DDR power source
- Инв. № дубл.
- Взам. инв. №
- Разраб.
- Изм.
- Лист
- № докум.
- Подп.
- Дата
- Лит.
- Масса
- Масштаб
- Пров.
- Т.контр.
- Листов
- Инв. № подл.
- Утв.
- Н.контр.
- 2.106-A3
- Копировал
- Формат А3
- (in symbol RK3399_FF, part D) DDRC0
- (in symbol RK3399_FF, part E) DDRC1

### Library data of the parts
C177 C186 = Ceramic_Cap: PartNumber: CL10A226MP8NUNE; ComponentType: SMD Ceramic Chip Capacitor; Manufacter: *; Tolerance: *; ClassName: *; Value: 22uF
C178 C187 = Ceramic_Cap: PartNumber: CC0402MRX5R6BB106; ComponentType: SMD Ceramic Chip Capacitor; Manufacter: *; Tolerance: *; ClassName: Solder_Clearence; Value: 10uF
C179 C188 C195 C198 = Ceramic_Cap: PartNumber: CC0402KRX5R6BB105; ComponentType: SMD Ceramic Chip Capacitor; Manufacter: *; Tolerance: *; ClassName: Solder_Clearence; Value: 1uF
C180-C184 C189-C193 C196 C197 C199 C200 = Ceramic_Cap: PartNumber: CC0201KRX5R6BB104; ComponentType: SMD Ceramic Chip Capacitor; Manufacter: *; Tolerance: *; ClassName: *; Value: 0.1uF
C185 C194 = Ceramic_Cap: PartNumber: CC0402KRX5R6BB104; ComponentType: SMD Ceramic Chip Capacitor; Manufacter: *; Tolerance: *; ClassName: *; Value: 0.1uF
R55 R56 = Chip_Res: PartNumber: RC0201FR-07240RL; ComponentType: SMD Chip Resistor; Manufacter: *; Voltage: *; ClassName: *; Value: 240R
R57 R58 = Chip_Res: PartNumber: RC0402FR-070RL; ComponentType: SMD Chip Resistor; Manufacter: *; Voltage: *; ClassName: Solder_Clearence; Value: 0R
U1 = RK3399_FF: Package: BGA828; ComponentType: *; Manufacter: *; PartNumber: RK3399; ClassName: *

## Sheet 07 RAM_PWR.SchDoc
size 420 x 297 mm; Address1: Address1; Address2: Address2; Address3: Address3; Address4: Address4; DocumentNumber: АБВГ.123456.001 Э3; SheetNumber: 7; SheetTotal: 23; Scale: 1:1; DocumentType: Схема электрическая принципиальная; FirstReferrence: АБВГ.123456.001
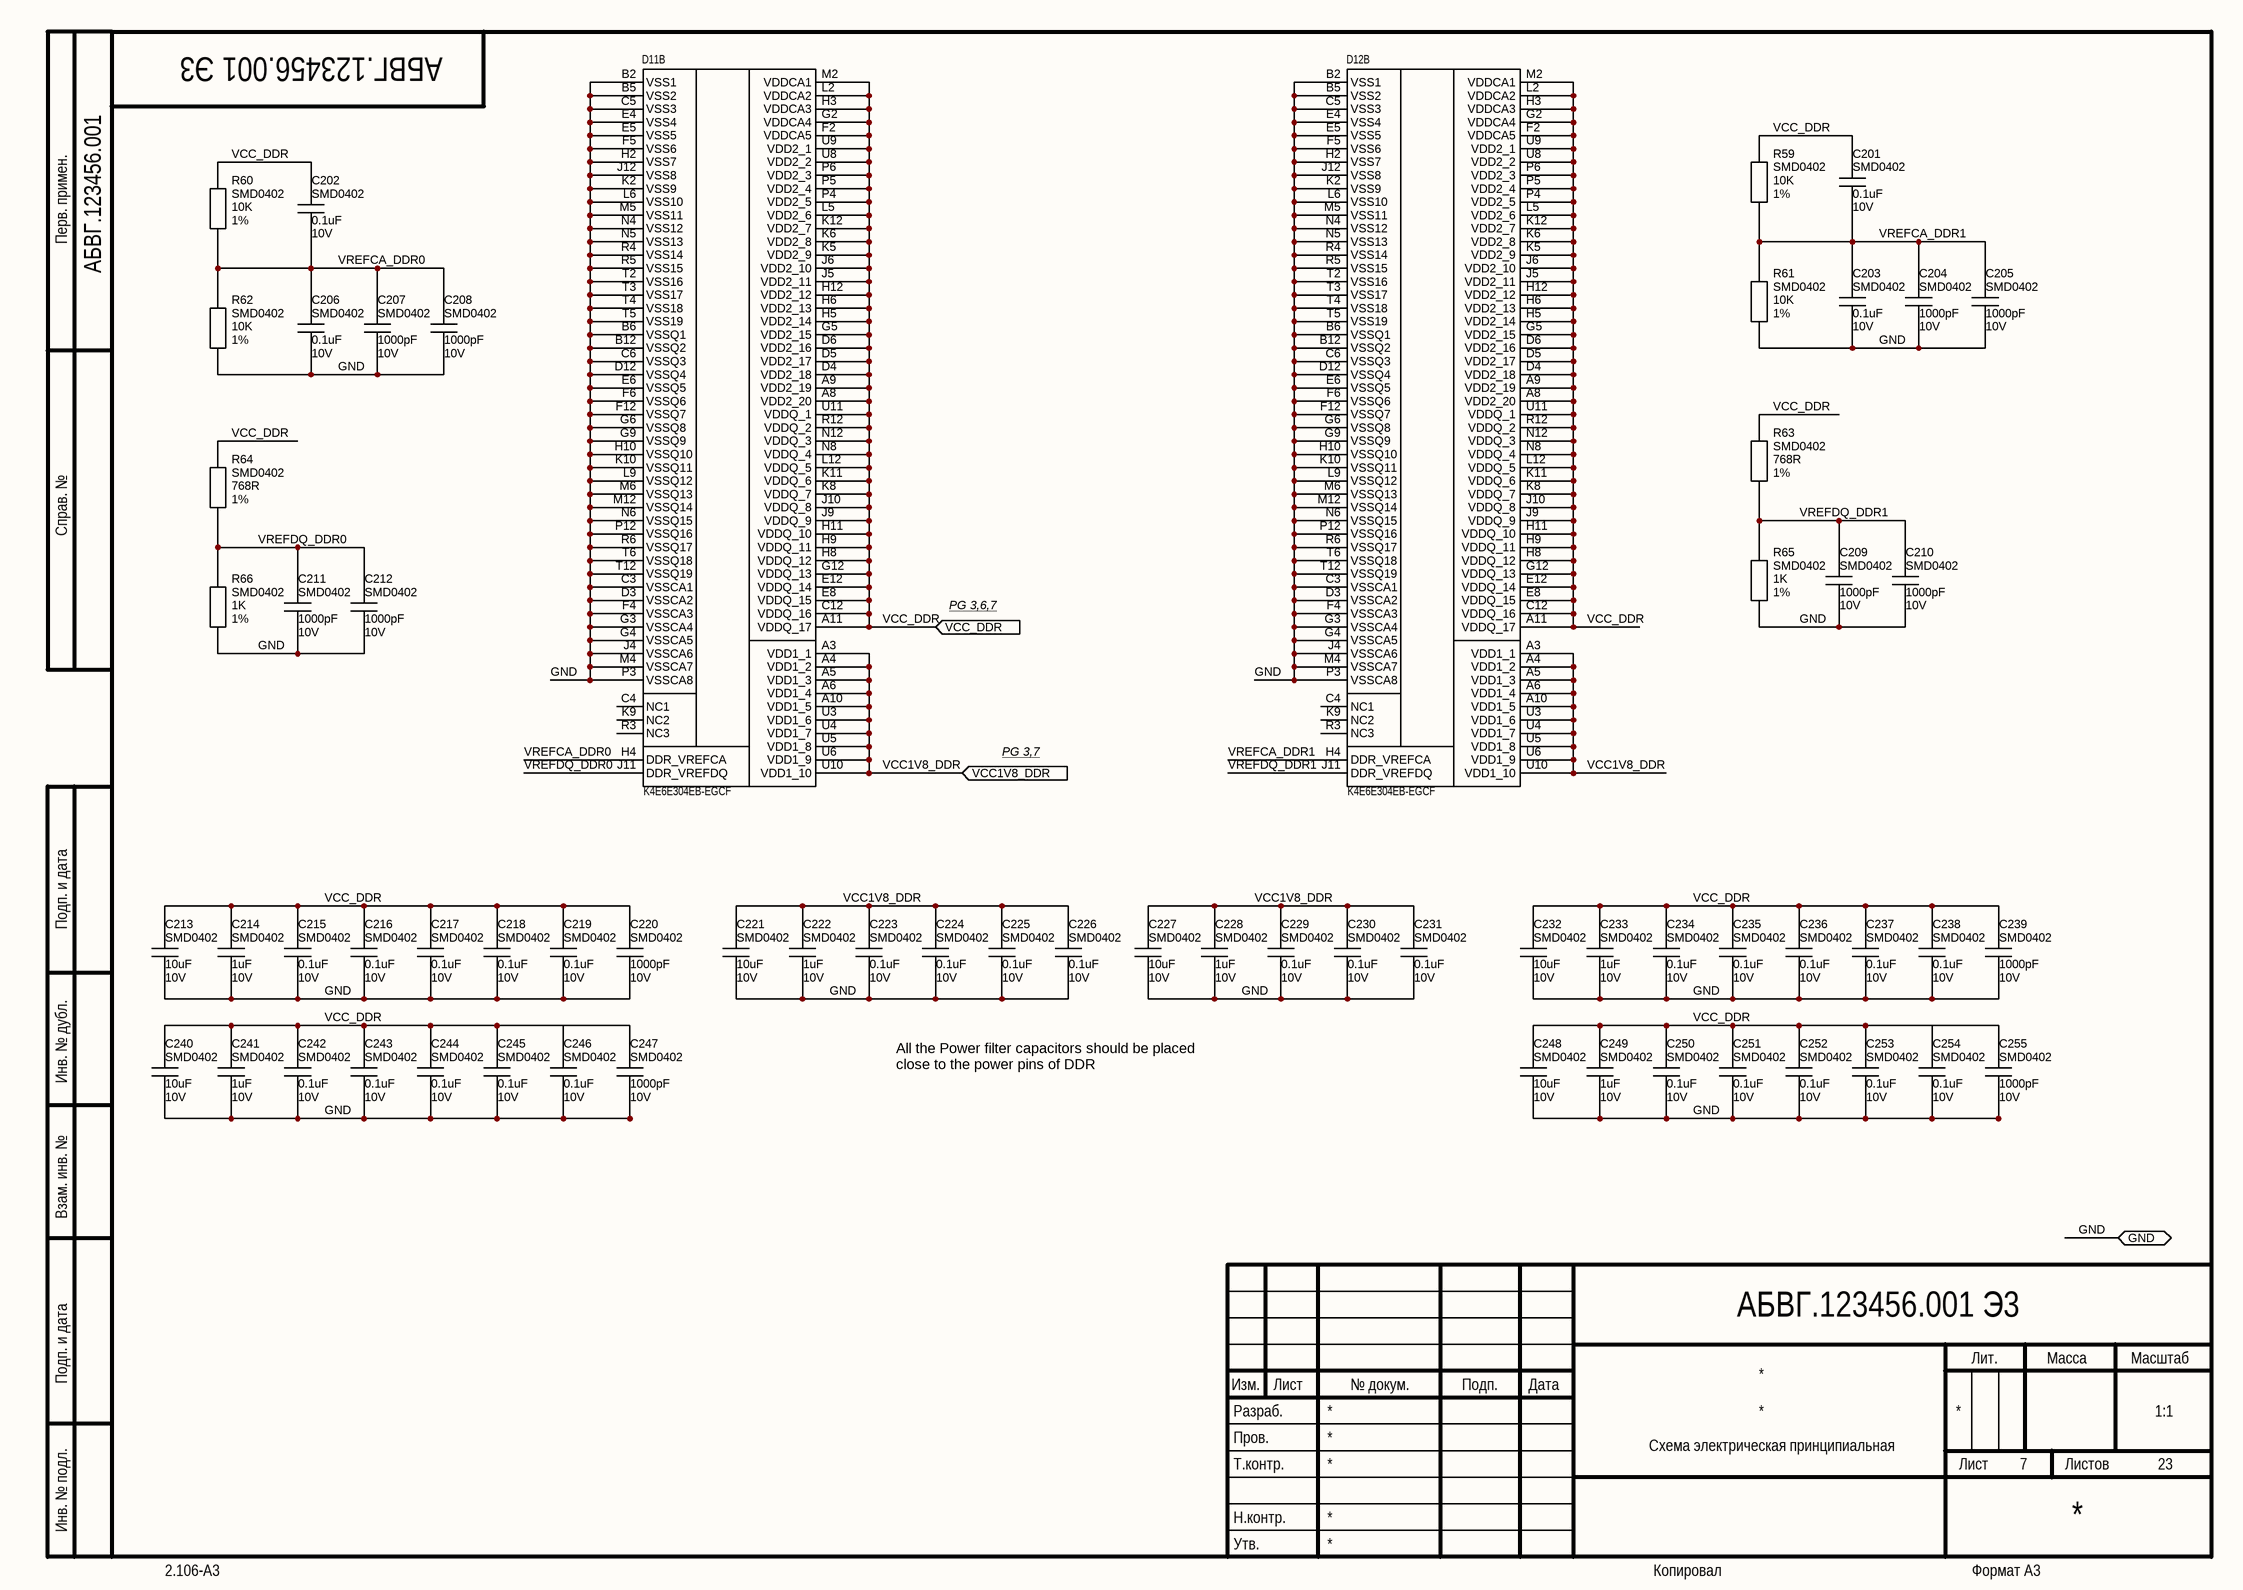
[diagram p6: 07 RAM_PWR.SchDoc]

### Parts
C201  Package: SMD0402  Voltage: 10V  [CAP_SMD_0402_small]  (hidden comment: 0.1uF)
C202  Package: SMD0402  Voltage: 10V  [CAP_SMD_0402_small]  (hidden comment: 0.1uF)
C203  Package: SMD0402  Voltage: 10V  [CAP_SMD_0402_small]  (hidden comment: 0.1uF)
C204  Package: SMD0402  Voltage: 10V  [CAP_SMD_0402_small]  (hidden comment: 1000pF)
C205  Package: SMD0402  Voltage: 10V  [CAP_SMD_0402_small]  (hidden comment: 1000pF)
C206  Package: SMD0402  Voltage: 10V  [CAP_SMD_0402_small]  (hidden comment: 0.1uF)
C207  Package: SMD0402  Voltage: 10V  [CAP_SMD_0402_small]  (hidden comment: 1000pF)
C208  Package: SMD0402  Voltage: 10V  [CAP_SMD_0402_small]  (hidden comment: 1000pF)
C209  Package: SMD0402  Voltage: 10V  [CAP_SMD_0402_small]  (hidden comment: 1000pF)
C210  Package: SMD0402  Voltage: 10V  [CAP_SMD_0402_small]  (hidden comment: 1000pF)
C211  Package: SMD0402  Voltage: 10V  [CAP_SMD_0402_small]  (hidden comment: 1000pF)
C212  Package: SMD0402  Voltage: 10V  [CAP_SMD_0402_small]  (hidden comment: 1000pF)
C213  Package: SMD0402  Voltage: 10V  [CAP_SMD_0402_small]  (hidden comment: 10uF)
C214  Package: SMD0402  Voltage: 10V  [CAP_SMD_0402_small]  (hidden comment: 1uF)
C215  Package: SMD0402  Voltage: 10V  [CAP_SMD_0402_small]  (hidden comment: 0.1uF)
C216  Package: SMD0402  Voltage: 10V  [CAP_SMD_0402_small]  (hidden comment: 0.1uF)
C217  Package: SMD0402  Voltage: 10V  [CAP_SMD_0402_small]  (hidden comment: 0.1uF)
C218  Package: SMD0402  Voltage: 10V  [CAP_SMD_0402_small]  (hidden comment: 0.1uF)
C219  Package: SMD0402  Voltage: 10V  [CAP_SMD_0402_small]  (hidden comment: 0.1uF)
C220  Package: SMD0402  Voltage: 10V  [CAP_SMD_0402_small]  (hidden comment: 1000pF)
C221  Package: SMD0402  Voltage: 10V  [CAP_SMD_0402_small]  (hidden comment: 10uF)
C222  Package: SMD0402  Voltage: 10V  [CAP_SMD_0402_small]  (hidden comment: 1uF)
C223  Package: SMD0402  Voltage: 10V  [CAP_SMD_0402_small]  (hidden comment: 0.1uF)
C224  Package: SMD0402  Voltage: 10V  [CAP_SMD_0402_small]  (hidden comment: 0.1uF)
C225  Package: SMD0402  Voltage: 10V  [CAP_SMD_0402_small]  (hidden comment: 0.1uF)
C226  Package: SMD0402  Voltage: 10V  [CAP_SMD_0402_small]  (hidden comment: 0.1uF)
C227  Package: SMD0402  Voltage: 10V  [CAP_SMD_0402_small]  (hidden comment: 10uF)
C228  Package: SMD0402  Voltage: 10V  [CAP_SMD_0402_small]  (hidden comment: 1uF)
C229  Package: SMD0402  Voltage: 10V  [CAP_SMD_0402_small]  (hidden comment: 0.1uF)
C230  Package: SMD0402  Voltage: 10V  [CAP_SMD_0402_small]  (hidden comment: 0.1uF)
C231  Package: SMD0402  Voltage: 10V  [CAP_SMD_0402_small]  (hidden comment: 0.1uF)
C232  Package: SMD0402  Voltage: 10V  [CAP_SMD_0402_small]  (hidden comment: 10uF)
C233  Package: SMD0402  Voltage: 10V  [CAP_SMD_0402_small]  (hidden comment: 1uF)
C234  Package: SMD0402  Voltage: 10V  [CAP_SMD_0402_small]  (hidden comment: 0.1uF)
C235  Package: SMD0402  Voltage: 10V  [CAP_SMD_0402_small]  (hidden comment: 0.1uF)
C236  Package: SMD0402  Voltage: 10V  [CAP_SMD_0402_small]  (hidden comment: 0.1uF)
C237  Package: SMD0402  Voltage: 10V  [CAP_SMD_0402_small]  (hidden comment: 0.1uF)
C238  Package: SMD0402  Voltage: 10V  [CAP_SMD_0402_small]  (hidden comment: 0.1uF)
C239  Package: SMD0402  Voltage: 10V  [CAP_SMD_0402_small]  (hidden comment: 1000pF)
C240  Package: SMD0402  Voltage: 10V  [CAP_SMD_0402_small]  (hidden comment: 10uF)
C241  Package: SMD0402  Voltage: 10V  [CAP_SMD_0402_small]  (hidden comment: 1uF)
C242  Package: SMD0402  Voltage: 10V  [CAP_SMD_0402_small]  (hidden comment: 0.1uF)
C243  Package: SMD0402  Voltage: 10V  [CAP_SMD_0402_small]  (hidden comment: 0.1uF)
C244  Package: SMD0402  Voltage: 10V  [CAP_SMD_0402_small]  (hidden comment: 0.1uF)
C245  Package: SMD0402  Voltage: 10V  [CAP_SMD_0402_small]  (hidden comment: 0.1uF)
C246  Package: SMD0402  Voltage: 10V  [CAP_SMD_0402_small]  (hidden comment: 0.1uF)
C247  Package: SMD0402  Voltage: 10V  [CAP_SMD_0402_small]  (hidden comment: 1000pF)
C248  Package: SMD0402  Voltage: 10V  [CAP_SMD_0402_small]  (hidden comment: 10uF)
C249  Package: SMD0402  Voltage: 10V  [CAP_SMD_0402_small]  (hidden comment: 1uF)
C250  Package: SMD0402  Voltage: 10V  [CAP_SMD_0402_small]  (hidden comment: 0.1uF)
C251  Package: SMD0402  Voltage: 10V  [CAP_SMD_0402_small]  (hidden comment: 0.1uF)
C252  Package: SMD0402  Voltage: 10V  [CAP_SMD_0402_small]  (hidden comment: 0.1uF)
C253  Package: SMD0402  Voltage: 10V  [CAP_SMD_0402_small]  (hidden comment: 0.1uF)
C254  Package: SMD0402  Voltage: 10V  [CAP_SMD_0402_small]  (hidden comment: 0.1uF)
C255  Package: SMD0402  Voltage: 10V  [CAP_SMD_0402_small]  (hidden comment: 1000pF)
D11  K4E6E304EB-EGCF  [FBGA178_13R00X11R50X1R20]  (part B of 2)
D12  K4E6E304EB-EGCF  [FBGA178_13R00X11R50X1R20]  (part B of 2)
R59  Package: SMD0402  Tolerance: 1%  [RES_SMD_0402_SMALL]  (hidden comment: 10K)
R60  Package: SMD0402  Tolerance: 1%  [RES_SMD_0402_SMALL]  (hidden comment: 10K)
R61  Package: SMD0402  Tolerance: 1%  [RES_SMD_0402_SMALL]  (hidden comment: 10K)
R62  Package: SMD0402  Tolerance: 1%  [RES_SMD_0402_SMALL]  (hidden comment: 10K)
R63  Package: SMD0402  Tolerance: 1%  [RES_SMD_0402_SMALL]  (hidden comment: 768R)
R64  Package: SMD0402  Tolerance: 1%  [RES_SMD_0402_SMALL]  (hidden comment: 768R)
R65  Package: SMD0402  Tolerance: 1%  [RES_SMD_0402_SMALL]  (hidden comment: 1K)
R66  Package: SMD0402  Tolerance: 1%  [RES_SMD_0402_SMALL]  (hidden comment: 1K)

### Ports
GND (bidir), VCC1V8_DDR (in), VCC_DDR (in)

### Nets
GND: C203.2 C204.1 C205.1 C206.2 C207.1 C208.1 C209.1 C210.1 C211.1 C212.1 C213.2 C214.2 C215.2 C216.2 C217.2 C218.2 C219.2 C220.1 C221.2 C222.2 C223.2 C224.2 C225.2 C226.2 C227.2 C228.2 C229.2 C230.2 C231.2 C232.2 C233.2 C234.2 C235.2 C236.2 C237.2 C238.2 C239.1 C240.2 C241.2 C242.2 C243.2 C244.2 C245.2 C246.2 C247.1 C248.2 C249.2 C250.2 C251.2 C252.2 C253.2 C254.2 C255.1 D11.B2(VSS1) D11.B5(VSS2) D11.B6(VSSQ1) D11.B12(VSSQ2) D11.C3(VSSCA1) D11.C5(VSS3) D11.C6(VSSQ3) D11.D3(VSSCA2) D11.D12(VSSQ4) D11.E4(VSS4) D11.E5(VSS5) D11.E6(VSSQ5) D11.F4(VSSCA3) D11.F5(VSS6) D11.F6(VSSQ6) D11.F12(VSSQ7) D11.G3(VSSCA4) D11.G4(VSSCA5) D11.G6(VSSQ8) D11.G9(VSSQ9) D11.H2(VSS7) D11.H10(VSSQ10) D11.J4(VSSCA6) D11.J12(VSS8) D11.K2(VSS9) D11.K10(VSSQ11) D11.L6(VSS10) D11.L9(VSSQ12) D11.M4(VSSCA7) D11.M5(VSS11) D11.M6(VSSQ13) D11.M12(VSSQ14) D11.N4(VSS12) D11.N5(VSS13) D11.N6(VSSQ15) D11.P3(VSSCA8) D11.P12(VSSQ16) D11.R4(VSS14) D11.R5(VSS15) D11.R6(VSSQ17) D11.T2(VSS16) D11.T3(VSS17) D11.T4(VSS18) D11.T5(VSS19) D11.T6(VSSQ18) D11.T12(VSSQ19) D12.B2(VSS1) D12.B5(VSS2) D12.B6(VSSQ1) D12.B12(VSSQ2) D12.C3(VSSCA1) D12.C5(VSS3) D12.C6(VSSQ3) D12.D3(VSSCA2) D12.D12(VSSQ4) D12.E4(VSS4) D12.E5(VSS5) D12.E6(VSSQ5) D12.F4(VSSCA3) D12.F5(VSS6) D12.F6(VSSQ6) D12.F12(VSSQ7) D12.G3(VSSCA4) D12.G4(VSSCA5) D12.G6(VSSQ8) D12.G9(VSSQ9) D12.H2(VSS7) D12.H10(VSSQ10) D12.J4(VSSCA6) D12.J12(VSS8) D12.K2(VSS9) D12.K10(VSSQ11) D12.L6(VSS10) D12.L9(VSSQ12) D12.M4(VSSCA7) D12.M5(VSS11) D12.M6(VSSQ13) D12.M12(VSSQ14) D12.N4(VSS12) D12.N5(VSS13) D12.N6(VSSQ15) D12.P3(VSSCA8) D12.P12(VSSQ16) D12.R4(VSS14) D12.R5(VSS15) D12.R6(VSSQ17) D12.T2(VSS16) D12.T3(VSS17) D12.T4(VSS18) D12.T5(VSS19) D12.T6(VSSQ18) D12.T12(VSSQ19) R61.1 R62.1 R65.1 R66.1 ; port GND
VCC1V8_DDR: C221.1 C222.1 C223.1 C224.1 C225.1 C226.1 C227.1 C228.1 C229.1 C230.1 C231.1 D11.A3(VDD1_1) D11.A4(VDD1_2) D11.A5(VDD1_3) D11.A6(VDD1_4) D11.A10(VDD1_5) D11.U3(VDD1_6) D11.U4(VDD1_7) D11.U5(VDD1_8) D11.U6(VDD1_9) D11.U10(VDD1_10) D12.A3(VDD1_1) D12.A4(VDD1_2) D12.A5(VDD1_3) D12.A6(VDD1_4) D12.A10(VDD1_5) D12.U3(VDD1_6) D12.U4(VDD1_7) D12.U5(VDD1_8) D12.U6(VDD1_9) D12.U10(VDD1_10) ; port VCC1V8_DDR
VCC_DDR: C201.1 C202.1 C213.1 C214.1 C215.1 C216.1 C217.1 C218.1 C219.1 C220.2 C232.1 C233.1 C234.1 C235.1 C236.1 C237.1 C238.1 C239.2 C240.1 C241.1 C242.1 C243.1 C244.1 C245.1 C246.1 C247.2 C248.1 C249.1 C250.1 C251.1 C252.1 C253.1 C254.1 C255.2 D11.A8(VDD2_20) D11.A9(VDD2_19) D11.A11(VDDQ_17) D11.C12(VDDQ_16) D11.D4(VDD2_18) D11.D5(VDD2_17) D11.D6(VDD2_16) D11.E8(VDDQ_15) D11.E12(VDDQ_14) D11.F2(VDDCA5) D11.G2(VDDCA4) D11.G5(VDD2_15) D11.G12(VDDQ_13) D11.H3(VDDCA3) D11.H5(VDD2_14) D11.H6(VDD2_13) D11.H8(VDDQ_12) D11.H9(VDDQ_11) D11.H11(VDDQ_10) D11.H12(VDD2_12) D11.J5(VDD2_11) D11.J6(VDD2_10) D11.J9(VDDQ_9) D11.J10(VDDQ_8) D11.K5(VDD2_9) D11.K6(VDD2_8) D11.K8(VDDQ_7) D11.K11(VDDQ_6) D11.K12(VDD2_7) D11.L2(VDDCA2) D11.L5(VDD2_6) D11.L12(VDDQ_5) D11.M2(VDDCA1) D11.N8(VDDQ_4) D11.N12(VDDQ_3) D11.P4(VDD2_5) D11.P5(VDD2_4) D11.P6(VDD2_3) D11.R12(VDDQ_2) D11.U8(VDD2_2) D11.U9(VDD2_1) D11.U11(VDDQ_1) D12.A8(VDD2_20) D12.A9(VDD2_19) D12.A11(VDDQ_17) D12.C12(VDDQ_16) D12.D4(VDD2_18) D12.D5(VDD2_17) D12.D6(VDD2_16) D12.E8(VDDQ_15) D12.E12(VDDQ_14) D12.F2(VDDCA5) D12.G2(VDDCA4) D12.G5(VDD2_15) D12.G12(VDDQ_13) D12.H3(VDDCA3) D12.H5(VDD2_14) D12.H6(VDD2_13) D12.H8(VDDQ_12) D12.H9(VDDQ_11) D12.H11(VDDQ_10) D12.H12(VDD2_12) D12.J5(VDD2_11) D12.J6(VDD2_10) D12.J9(VDDQ_9) D12.J10(VDDQ_8) D12.K5(VDD2_9) D12.K6(VDD2_8) D12.K8(VDDQ_7) D12.K11(VDDQ_6) D12.K12(VDD2_7) D12.L2(VDDCA2) D12.L5(VDD2_6) D12.L12(VDDQ_5) D12.M2(VDDCA1) D12.N8(VDDQ_4) D12.N12(VDDQ_3) D12.P4(VDD2_5) D12.P5(VDD2_4) D12.P6(VDD2_3) D12.R12(VDDQ_2) D12.U8(VDD2_2) D12.U9(VDD2_1) D12.U11(VDDQ_1) R59.2 R60.2 R63.2 R64.2 ; port VCC_DDR
VREFCA_DDR0: C202.2 C206.1 C207.2 C208.2 D11.H4(DDR_VREFCA) R60.1 R62.2
VREFCA_DDR1: C201.2 C203.1 C204.2 C205.2 D12.H4(DDR_VREFCA) R59.1 R61.2
VREFDQ_DDR0: C211.2 C212.2 D11.J11(DDR_VREFDQ) R64.1 R66.2
VREFDQ_DDR1: C209.2 C210.2 D12.J11(DDR_VREFDQ) R63.1 R65.2

Not connected (* = marked no-connect by the designer): D11 C4(NC1) K9(NC2) R3(NC3); D12 C4(NC1) K9(NC2) R3(NC3)

### Notes on the sheet
- Перв. примен.
- Справ. №
- PG 3,6,7
- PG 3,7
- Подп. и дата
- Инв. № дубл.
- All the Power filter capacitors should be placed
  close to the power pins of DDR
- Взам. инв. №
- Разраб.
- Изм.
- Лист
- № докум.
- Подп.
- Дата
- Лит.
- Масса
- Масштаб
- Пров.
- Т.контр.
- Листов
- Инв. № подл.
- Утв.
- Н.контр.
- 2.106-A3
- Копировал
- Формат А3

### Library data of the parts
C201-C203 C206 C215-C219 C223-C226 C229-C231 C234-C238 C242-C246 C250-C254 = Ceramic_Cap: PartNumber: CC0402KRX5R6BB104; ComponentType: SMD Ceramic Chip Capacitor; Manufacter: *; Tolerance: *; ClassName: Solder_Clearence; Value: 0.1uF
C204 C205 C207-C212 C220 C239 C247 C255 = Ceramic_Cap: PartNumber: CC0402KRX7R9BB102; ComponentType: SMD Ceramic Chip Capacitor; Manufacter: *; Tolerance: *; ClassName: Solder_Clearence; Value: 1000pF
C213 C221 C227 C232 C240 C248 = Ceramic_Cap: PartNumber: CC0402MRX5R6BB106; ComponentType: SMD Ceramic Chip Capacitor; Manufacter: *; Tolerance: *; ClassName: Solder_Clearence; Value: 10uF
C214 C222 C228 C233 C241 C249 = Ceramic_Cap: PartNumber: CC0402KRX5R6BB105; ComponentType: SMD Ceramic Chip Capacitor; Manufacter: *; Tolerance: *; ClassName: Solder_Clearence; Value: 1uF
D11 D12 = K4E8E304EE-EGCE: ComponentType: *; Manufacter: *; Package: FBGA178; PartNumber: K4E6E304EB-EGCF; ClassName: *; Value: K4E6E304EB-EGCF
R59-R62 = Chip_Res: PartNumber: RC0402FR-0710KL; ComponentType: SMD Chip Resistor; Manufacter: *; Voltage: *; ClassName: Solder_Clearence; Value: 10K
R63 R64 = Chip_Res: PartNumber: RC0402FR-07768RL; ComponentType: SMD Chip Resistor; Manufacter: *; Voltage: *; ClassName: Solder_Clearence; Value: 768R
R65 R66 = Chip_Res: PartNumber: RC0402FR-071KL; ComponentType: SMD Chip Resistor; Manufacter: *; Voltage: *; ClassName: Solder_Clearence; Value: 1K

## Sheet 08 RAM.SchDoc
size 420 x 297 mm; Address1: Address1; Address2: Address2; Address3: Address3; Address4: Address4; DocumentNumber: АБВГ.123456.001 Э3; SheetNumber: 8; SheetTotal: 23; Scale: 1:1; DocumentType: Схема электрическая принципиальная; FirstReferrence: АБВГ.123456.001
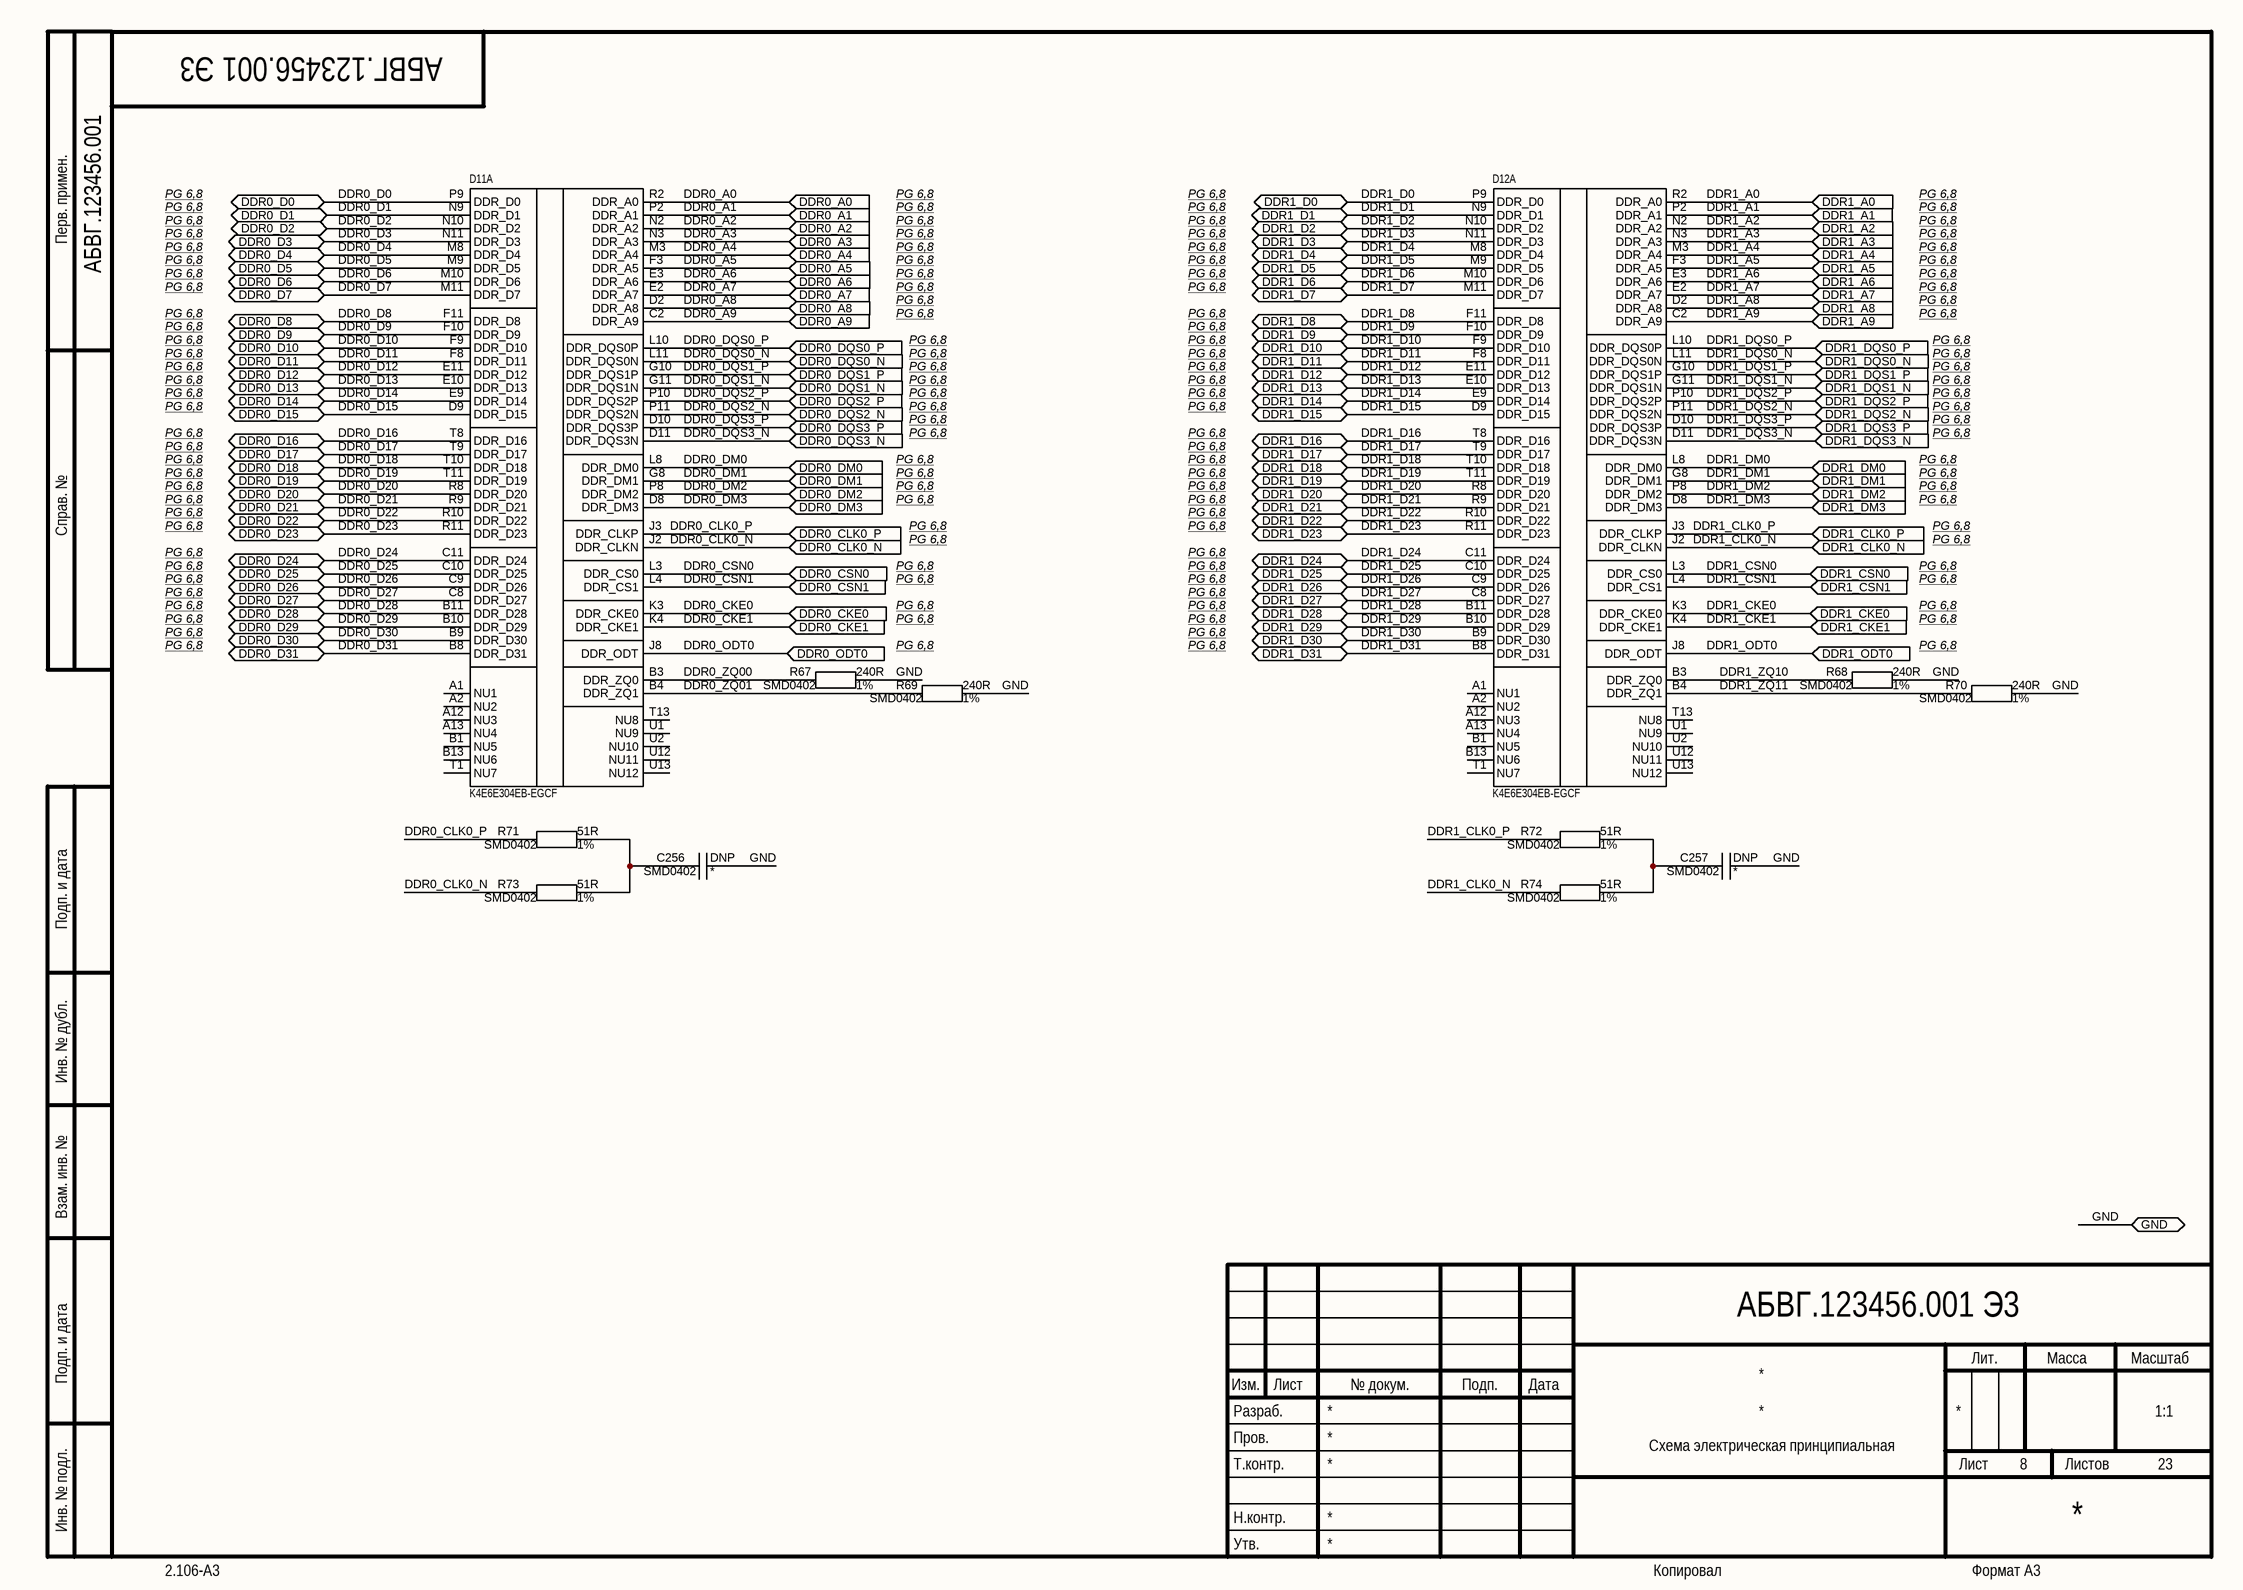
[diagram p7: 08 RAM.SchDoc]

### Parts
C256  Package: SMD0402  [CAP_SMD_0402_small]  (hidden comment: DNP)
C257  Package: SMD0402  [CAP_SMD_0402_small]  (hidden comment: DNP)
D11  K4E6E304EB-EGCF  [FBGA178_13R00X11R50X1R20]  (part A of 2)
D12  K4E6E304EB-EGCF  [FBGA178_13R00X11R50X1R20]  (part A of 2)
R67  Package: SMD0402  Tolerance: 1%  [RES_SMD_0402_SMALL]  (hidden comment: 240R)
R68  Package: SMD0402  Tolerance: 1%  [RES_SMD_0402_SMALL]  (hidden comment: 240R)
R69  Package: SMD0402  Tolerance: 1%  [RES_SMD_0402_SMALL]  (hidden comment: 240R)
R70  Package: SMD0402  Tolerance: 1%  [RES_SMD_0402_SMALL]  (hidden comment: 240R)
R71  Package: SMD0402  Tolerance: 1%  [RES_SMD_0402_SMALL]  (hidden comment: 51R)
R72  Package: SMD0402  Tolerance: 1%  [RES_SMD_0402_SMALL]  (hidden comment: 51R)
R73  Package: SMD0402  Tolerance: 1%  [RES_SMD_0402_SMALL]  (hidden comment: 51R)
R74  Package: SMD0402  Tolerance: 1%  [RES_SMD_0402_SMALL]  (hidden comment: 51R)

### Ports
DDR0_A0 (in), DDR0_A1 (in), DDR0_A2 (in), DDR0_A3 (in), DDR0_A4 (in), DDR0_A5 (in), DDR0_A6 (in), DDR0_A7 (in), DDR0_A8 (in), DDR0_A9 (in), DDR0_CKE0 (in), DDR0_CKE1 (in), DDR0_CLK0_N (in), DDR0_CLK0_P (in), DDR0_CSN0 (in), DDR0_CSN1 (in), DDR0_D0 (bidir), DDR0_D1 (bidir), DDR0_D2 (bidir), DDR0_D3 (bidir), DDR0_D4 (bidir), DDR0_D5 (bidir), DDR0_D6 (bidir), DDR0_D7 (bidir), DDR0_D8 (bidir), DDR0_D9 (bidir), DDR0_D10 (bidir), DDR0_D11 (bidir), DDR0_D12 (bidir), DDR0_D13 (bidir), DDR0_D14 (bidir), DDR0_D15 (bidir), DDR0_D16 (bidir), DDR0_D17 (bidir), DDR0_D18 (bidir), DDR0_D19 (bidir), DDR0_D20 (bidir), DDR0_D21 (bidir), DDR0_D22 (bidir), DDR0_D23 (bidir), DDR0_D24 (bidir), DDR0_D25 (bidir), DDR0_D26 (bidir), DDR0_D27 (bidir), DDR0_D28 (bidir), DDR0_D29 (bidir), DDR0_D30 (bidir), DDR0_D31 (bidir), DDR0_DM0 (in), DDR0_DM1 (in), DDR0_DM2 (in), DDR0_DM3 (in), DDR0_DQS0_N (in), DDR0_DQS0_P (in), DDR0_DQS1_N (in), DDR0_DQS1_P (in), DDR0_DQS2_N (in), DDR0_DQS2_P (in), DDR0_DQS3_N (in), DDR0_DQS3_P (in), DDR0_ODT0 (in), DDR1_A0 (in), DDR1_A1 (in), DDR1_A2 (in), DDR1_A3 (in), DDR1_A4 (in), DDR1_A5 (in), DDR1_A6 (in), DDR1_A7 (in), DDR1_A8 (in), DDR1_A9 (in), DDR1_CKE0 (in), DDR1_CKE1 (in), DDR1_CLK0_N (in), DDR1_CLK0_P (in), DDR1_CSN0 (in), DDR1_CSN1 (in), DDR1_D0 (bidir), DDR1_D1 (bidir), DDR1_D2 (bidir), DDR1_D3 (bidir), DDR1_D4 (bidir), DDR1_D5 (bidir), DDR1_D6 (bidir), DDR1_D7 (bidir), DDR1_D8 (bidir), DDR1_D9 (bidir), DDR1_D10 (bidir), DDR1_D11 (bidir), DDR1_D12 (bidir), DDR1_D13 (bidir), DDR1_D14 (bidir), DDR1_D15 (bidir), DDR1_D16 (bidir), DDR1_D17 (bidir), DDR1_D18 (bidir), DDR1_D19 (bidir), DDR1_D20 (bidir), DDR1_D21 (bidir), DDR1_D22 (bidir), DDR1_D23 (bidir), DDR1_D24 (bidir), DDR1_D25 (bidir), DDR1_D26 (bidir), DDR1_D27 (bidir), DDR1_D28 (bidir), DDR1_D29 (bidir), DDR1_D30 (bidir), DDR1_D31 (bidir), DDR1_DM0 (in), DDR1_DM1 (in), DDR1_DM2 (in), DDR1_DM3 (in), DDR1_DQS0_N (in), DDR1_DQS0_P (in), DDR1_DQS1_N (in), DDR1_DQS1_P (in), DDR1_DQS2_N (in), DDR1_DQS2_P (in), DDR1_DQS3_N (in), DDR1_DQS3_P (in), DDR1_ODT0 (in), GND (bidir)

### Nets
DDR0_A0: D11.R2(DDR_A0) ; port DDR0_A0
DDR0_A1: D11.P2(DDR_A1) ; port DDR0_A1
DDR0_A2: D11.N2(DDR_A2) ; port DDR0_A2
DDR0_A3: D11.N3(DDR_A3) ; port DDR0_A3
DDR0_A4: D11.M3(DDR_A4) ; port DDR0_A4
DDR0_A5: D11.F3(DDR_A5) ; port DDR0_A5
DDR0_A6: D11.E3(DDR_A6) ; port DDR0_A6
DDR0_A7: D11.E2(DDR_A7) ; port DDR0_A7
DDR0_A8: D11.D2(DDR_A8) ; port DDR0_A8
DDR0_A9: D11.C2(DDR_A9) ; port DDR0_A9
DDR0_CKE0: D11.K3(DDR_CKE0) ; port DDR0_CKE0
DDR0_CKE1: D11.K4(DDR_CKE1) ; port DDR0_CKE1
DDR0_CLK0_N: D11.J2(DDR_CLKN) R73.2 ; port DDR0_CLK0_N
DDR0_CLK0_P: D11.J3(DDR_CLKP) R71.2 ; port DDR0_CLK0_P
DDR0_CSN0: D11.L3(DDR_CS0) ; port DDR0_CSN0
DDR0_CSN1: D11.L4(DDR_CS1) ; port DDR0_CSN1
DDR0_D0: D11.P9(DDR_D0) ; port DDR0_D0
DDR0_D1: D11.N9(DDR_D1) ; port DDR0_D1
DDR0_D2: D11.N10(DDR_D2) ; port DDR0_D2
DDR0_D3: D11.N11(DDR_D3) ; port DDR0_D3
DDR0_D4: D11.M8(DDR_D4) ; port DDR0_D4
DDR0_D5: D11.M9(DDR_D5) ; port DDR0_D5
DDR0_D6: D11.M10(DDR_D6) ; port DDR0_D6
DDR0_D7: D11.M11(DDR_D7) ; port DDR0_D7
DDR0_D8: D11.F11(DDR_D8) ; port DDR0_D8
DDR0_D9: D11.F10(DDR_D9) ; port DDR0_D9
DDR0_D10: D11.F9(DDR_D10) ; port DDR0_D10
DDR0_D11: D11.F8(DDR_D11) ; port DDR0_D11
DDR0_D12: D11.E11(DDR_D12) ; port DDR0_D12
DDR0_D13: D11.E10(DDR_D13) ; port DDR0_D13
DDR0_D14: D11.E9(DDR_D14) ; port DDR0_D14
DDR0_D15: D11.D9(DDR_D15) ; port DDR0_D15
DDR0_D16: D11.T8(DDR_D16) ; port DDR0_D16
DDR0_D17: D11.T9(DDR_D17) ; port DDR0_D17
DDR0_D18: D11.T10(DDR_D18) ; port DDR0_D18
DDR0_D19: D11.T11(DDR_D19) ; port DDR0_D19
DDR0_D20: D11.R8(DDR_D20) ; port DDR0_D20
DDR0_D21: D11.R9(DDR_D21) ; port DDR0_D21
DDR0_D22: D11.R10(DDR_D22) ; port DDR0_D22
DDR0_D23: D11.R11(DDR_D23) ; port DDR0_D23
DDR0_D24: D11.C11(DDR_D24) ; port DDR0_D24
DDR0_D25: D11.C10(DDR_D25) ; port DDR0_D25
DDR0_D26: D11.C9(DDR_D26) ; port DDR0_D26
DDR0_D27: D11.C8(DDR_D27) ; port DDR0_D27
DDR0_D28: D11.B11(DDR_D28) ; port DDR0_D28
DDR0_D29: D11.B10(DDR_D29) ; port DDR0_D29
DDR0_D30: D11.B9(DDR_D30) ; port DDR0_D30
DDR0_D31: D11.B8(DDR_D31) ; port DDR0_D31
DDR0_DM0: D11.L8(DDR_DM0) ; port DDR0_DM0
DDR0_DM1: D11.G8(DDR_DM1) ; port DDR0_DM1
DDR0_DM2: D11.P8(DDR_DM2) ; port DDR0_DM2
DDR0_DM3: D11.D8(DDR_DM3) ; port DDR0_DM3
DDR0_DQS0_N: D11.L11(DDR_DQS0N) ; port DDR0_DQS0_N
DDR0_DQS0_P: D11.L10(DDR_DQS0P) ; port DDR0_DQS0_P
DDR0_DQS1_N: D11.G11(DDR_DQS1N) ; port DDR0_DQS1_N
DDR0_DQS1_P: D11.G10(DDR_DQS1P) ; port DDR0_DQS1_P
DDR0_DQS2_N: D11.P11(DDR_DQS2N) ; port DDR0_DQS2_N
DDR0_DQS2_P: D11.P10(DDR_DQS2P) ; port DDR0_DQS2_P
DDR0_DQS3_N: D11.D11(DDR_DQS3N) ; port DDR0_DQS3_N
DDR0_DQS3_P: D11.D10(DDR_DQS3P) ; port DDR0_DQS3_P
DDR0_ODT0: D11.J8(DDR_ODT) ; port DDR0_ODT0
DDR0_ZQ00: D11.B3(DDR_ZQ0) R67.2
DDR0_ZQ01: D11.B4(DDR_ZQ1) R69.2
DDR1_A0: D12.R2(DDR_A0) ; port DDR1_A0
DDR1_A1: D12.P2(DDR_A1) ; port DDR1_A1
DDR1_A2: D12.N2(DDR_A2) ; port DDR1_A2
DDR1_A3: D12.N3(DDR_A3) ; port DDR1_A3
DDR1_A4: D12.M3(DDR_A4) ; port DDR1_A4
DDR1_A5: D12.F3(DDR_A5) ; port DDR1_A5
DDR1_A6: D12.E3(DDR_A6) ; port DDR1_A6
DDR1_A7: D12.E2(DDR_A7) ; port DDR1_A7
DDR1_A8: D12.D2(DDR_A8) ; port DDR1_A8
DDR1_A9: D12.C2(DDR_A9) ; port DDR1_A9
DDR1_CKE0: D12.K3(DDR_CKE0) ; port DDR1_CKE0
DDR1_CKE1: D12.K4(DDR_CKE1) ; port DDR1_CKE1
DDR1_CLK0_N: D12.J2(DDR_CLKN) R74.2 ; port DDR1_CLK0_N
DDR1_CLK0_P: D12.J3(DDR_CLKP) R72.2 ; port DDR1_CLK0_P
DDR1_CSN0: D12.L3(DDR_CS0) ; port DDR1_CSN0
DDR1_CSN1: D12.L4(DDR_CS1) ; port DDR1_CSN1
DDR1_D0: D12.P9(DDR_D0) ; port DDR1_D0
DDR1_D1: D12.N9(DDR_D1) ; port DDR1_D1
DDR1_D2: D12.N10(DDR_D2) ; port DDR1_D2
DDR1_D3: D12.N11(DDR_D3) ; port DDR1_D3
DDR1_D4: D12.M8(DDR_D4) ; port DDR1_D4
DDR1_D5: D12.M9(DDR_D5) ; port DDR1_D5
DDR1_D6: D12.M10(DDR_D6) ; port DDR1_D6
DDR1_D7: D12.M11(DDR_D7) ; port DDR1_D7
DDR1_D8: D12.F11(DDR_D8) ; port DDR1_D8
DDR1_D9: D12.F10(DDR_D9) ; port DDR1_D9
DDR1_D10: D12.F9(DDR_D10) ; port DDR1_D10
DDR1_D11: D12.F8(DDR_D11) ; port DDR1_D11
DDR1_D12: D12.E11(DDR_D12) ; port DDR1_D12
DDR1_D13: D12.E10(DDR_D13) ; port DDR1_D13
DDR1_D14: D12.E9(DDR_D14) ; port DDR1_D14
DDR1_D15: D12.D9(DDR_D15) ; port DDR1_D15
DDR1_D16: D12.T8(DDR_D16) ; port DDR1_D16
DDR1_D17: D12.T9(DDR_D17) ; port DDR1_D17
DDR1_D18: D12.T10(DDR_D18) ; port DDR1_D18
DDR1_D19: D12.T11(DDR_D19) ; port DDR1_D19
DDR1_D20: D12.R8(DDR_D20) ; port DDR1_D20
DDR1_D21: D12.R9(DDR_D21) ; port DDR1_D21
DDR1_D22: D12.R10(DDR_D22) ; port DDR1_D22
DDR1_D23: D12.R11(DDR_D23) ; port DDR1_D23
DDR1_D24: D12.C11(DDR_D24) ; port DDR1_D24
DDR1_D25: D12.C10(DDR_D25) ; port DDR1_D25
DDR1_D26: D12.C9(DDR_D26) ; port DDR1_D26
DDR1_D27: D12.C8(DDR_D27) ; port DDR1_D27
DDR1_D28: D12.B11(DDR_D28) ; port DDR1_D28
DDR1_D29: D12.B10(DDR_D29) ; port DDR1_D29
DDR1_D30: D12.B9(DDR_D30) ; port DDR1_D30
DDR1_D31: D12.B8(DDR_D31) ; port DDR1_D31
DDR1_DM0: D12.L8(DDR_DM0) ; port DDR1_DM0
DDR1_DM1: D12.G8(DDR_DM1) ; port DDR1_DM1
DDR1_DM2: D12.P8(DDR_DM2) ; port DDR1_DM2
DDR1_DM3: D12.D8(DDR_DM3) ; port DDR1_DM3
DDR1_DQS0_N: D12.L11(DDR_DQS0N) ; port DDR1_DQS0_N
DDR1_DQS0_P: D12.L10(DDR_DQS0P) ; port DDR1_DQS0_P
DDR1_DQS1_N: D12.G11(DDR_DQS1N) ; port DDR1_DQS1_N
DDR1_DQS1_P: D12.G10(DDR_DQS1P) ; port DDR1_DQS1_P
DDR1_DQS2_N: D12.P11(DDR_DQS2N) ; port DDR1_DQS2_N
DDR1_DQS2_P: D12.P10(DDR_DQS2P) ; port DDR1_DQS2_P
DDR1_DQS3_N: D12.D11(DDR_DQS3N) ; port DDR1_DQS3_N
DDR1_DQS3_P: D12.D10(DDR_DQS3P) ; port DDR1_DQS3_P
DDR1_ODT0: D12.J8(DDR_ODT) ; port DDR1_ODT0
DDR1_ZQ10: D12.B3(DDR_ZQ0) R68.2
DDR1_ZQ11: D12.B4(DDR_ZQ1) R70.2
GND: C256.1 C257.1 R67.1 R68.1 R69.1 R70.1 ; port GND
NetC256_2: C256.2 R71.1 R73.1
NetC257_2: C257.2 R72.1 R74.1

Not connected (* = marked no-connect by the designer): D11 A1(NU1) A2(NU2) A12(NU3) A13(NU4) B1(NU5) B13(NU6) T1(NU7) T13(NU8) U1(NU9) U2(NU10) U12(NU11) U13(NU12); D12 A1(NU1) A2(NU2) A12(NU3) A13(NU4) B1(NU5) B13(NU6) T1(NU7) T13(NU8) U1(NU9) U2(NU10) U12(NU11) U13(NU12)

### Notes on the sheet
- Перв. примен.
- PG 6,8
- Справ. №
- Подп. и дата
- Инв. № дубл.
- Взам. инв. №
- Разраб.
- Изм.
- Лист
- № докум.
- Подп.
- Дата
- Лит.
- Масса
- Масштаб
- Пров.
- Т.контр.
- Листов
- Инв. № подл.
- Утв.
- Н.контр.
- 2.106-A3
- Копировал
- Формат А3

### Library data of the parts
C256 C257 = Ceramic_Cap: PartNumber: Do Not Place; ComponentType: SMD Ceramic Chip Capacitor; Manufacter: *; Tolerance: *; ClassName: Solder_Clearence; Value: DNP; Voltage: *
D11 D12 = K4E8E304EE-EGCE: ComponentType: *; Manufacter: *; Package: FBGA178; PartNumber: K4E6E304EB-EGCF; ClassName: *; Value: K4E6E304EB-EGCF
R67-R70 = Chip_Res: PartNumber: RC0402FR-07240RL; ComponentType: SMD Chip Resistor; Manufacter: *; Voltage: *; ClassName: Solder_Clearence; Value: 240R
R71-R74 = Chip_Res: PartNumber: RC0402FR-0751RL; ComponentType: SMD Chip Resistor; Manufacter: *; Voltage: *; ClassName: Solder_Clearence; Value: 51R